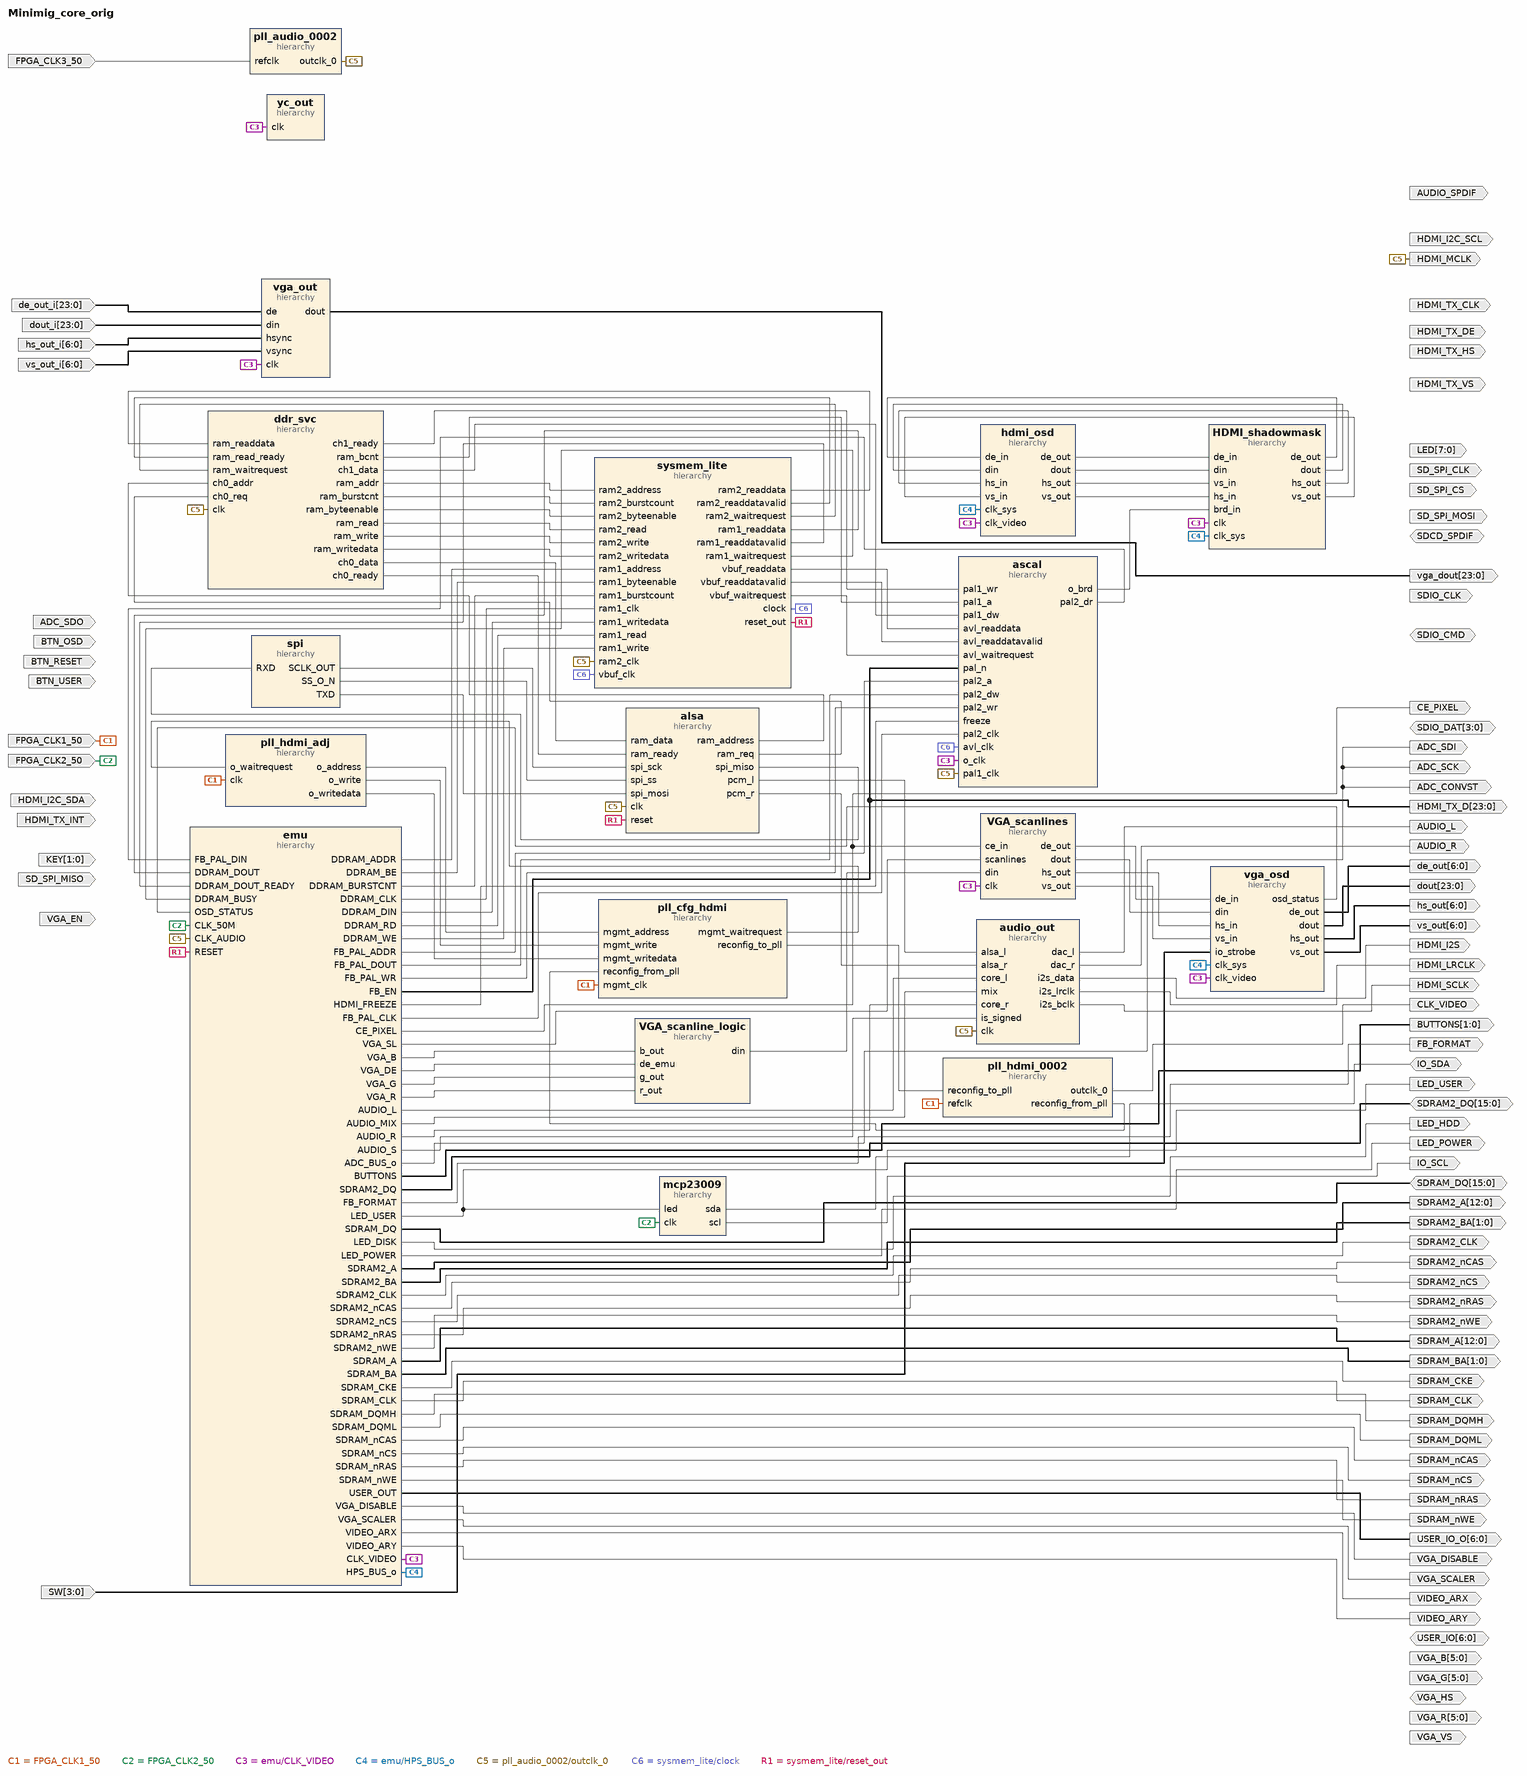
[diagram p0: block diagram of the top level]
# Vivado block design Minimig_core_orig, xc7a200tfbg484-2, Vivado 2024.2.1
create_bd_design Minimig_core_orig

create_bd_port -dir I -type clk FPGA_CLK1_50
set_property -dict {CONFIG.FREQ_HZ 50000000} [get_bd_ports FPGA_CLK1_50]
create_bd_port -dir I -type clk FPGA_CLK2_50
set_property -dict {CONFIG.FREQ_HZ 50000000} [get_bd_ports FPGA_CLK2_50]
create_bd_port -dir I -type clk FPGA_CLK3_50
set_property -dict {CONFIG.FREQ_HZ 50000000} [get_bd_ports FPGA_CLK3_50]
create_bd_port -dir O HDMI_I2C_SCL
create_bd_port -dir I HDMI_I2C_SDA
create_bd_port -dir O HDMI_MCLK
create_bd_port -dir O HDMI_SCLK
create_bd_port -dir O HDMI_LRCLK
create_bd_port -dir O HDMI_I2S
create_bd_port -dir O HDMI_TX_DE
create_bd_port -dir O HDMI_TX_CLK
create_bd_port -dir O -from 23 -to 0 HDMI_TX_D
create_bd_port -dir O HDMI_TX_HS
create_bd_port -dir O HDMI_TX_VS
create_bd_port -dir I HDMI_TX_INT
create_bd_port -dir O -from 12 -to 0 SDRAM_A
create_bd_port -dir O SDRAM_DQML
create_bd_port -dir O SDRAM_DQMH
create_bd_port -dir O SDRAM_nWE
create_bd_port -dir O SDRAM_nCAS
create_bd_port -dir O SDRAM_nRAS
create_bd_port -dir O SDRAM_nCS
create_bd_port -dir O -from 1 -to 0 SDRAM_BA
create_bd_port -dir O -type clk SDRAM_CLK
create_bd_port -dir O SDRAM_CKE
create_bd_port -dir O -from 12 -to 0 SDRAM2_A
create_bd_port -dir IO -from 15 -to 0 SDRAM2_DQ
create_bd_port -dir O SDRAM2_nWE
create_bd_port -dir O SDRAM2_nCAS
create_bd_port -dir O SDRAM2_nRAS
create_bd_port -dir O SDRAM2_nCS
create_bd_port -dir O -from 1 -to 0 SDRAM2_BA
create_bd_port -dir O -type clk SDRAM2_CLK
create_bd_port -dir O -from 5 -to 0 VGA_R
create_bd_port -dir O -from 5 -to 0 VGA_G
create_bd_port -dir O -from 5 -to 0 VGA_B
create_bd_port -dir IO VGA_HS
create_bd_port -dir O VGA_VS
create_bd_port -dir I VGA_EN
create_bd_port -dir O AUDIO_L
create_bd_port -dir O AUDIO_R
create_bd_port -dir O AUDIO_SPDIF
create_bd_port -dir IO -from 3 -to 0 SDIO_DAT
create_bd_port -dir IO SDIO_CMD
create_bd_port -dir O -type clk SDIO_CLK
create_bd_port -dir O LED_USER
create_bd_port -dir O LED_HDD
create_bd_port -dir O LED_POWER
create_bd_port -dir I BTN_USER
create_bd_port -dir I BTN_OSD
create_bd_port -dir I BTN_RESET
create_bd_port -dir O SD_SPI_CS
create_bd_port -dir I SD_SPI_MISO
create_bd_port -dir O -type clk SD_SPI_CLK
create_bd_port -dir O SD_SPI_MOSI
create_bd_port -dir IO SDCD_SPDIF
create_bd_port -dir O IO_SCL
create_bd_port -dir IO IO_SDA
create_bd_port -dir O ADC_SCK
create_bd_port -dir I ADC_SDO
create_bd_port -dir O ADC_SDI
create_bd_port -dir O ADC_CONVST
create_bd_port -dir I -from 1 -to 0 KEY
create_bd_port -dir I -from 3 -to 0 SW
create_bd_port -dir O -from 7 -to 0 LED
create_bd_port -dir IO -from 6 -to 0 USER_IO
create_bd_port -dir O CE_PIXEL
create_bd_port -dir O VIDEO_ARX
create_bd_port -dir O VIDEO_ARY
create_bd_port -dir O VGA_SCALER
create_bd_port -dir O VGA_DISABLE
create_bd_port -dir O FB_FORMAT
create_bd_port -dir O -from 1 -to 0 BUTTONS
create_bd_port -dir IO -from 15 -to 0 SDRAM_DQ
create_bd_port -dir O -from 6 -to 0 USER_IO_O
create_bd_port -dir O CLK_VIDEO
create_bd_port -dir O -from 23 -to 0 dout
create_bd_port -dir O -from 6 -to 0 de_out
create_bd_port -dir O -from 6 -to 0 vs_out
create_bd_port -dir O -from 6 -to 0 hs_out
create_bd_port -dir I -from 6 -to 0 hs_out_i
create_bd_port -dir I -from 6 -to 0 vs_out_i
create_bd_port -dir I -from 23 -to 0 de_out_i
create_bd_port -dir I -from 23 -to 0 dout_i
create_bd_port -dir O -from 23 -to 0 vga_dout

create_bd_cell -type hier HDMI_shadowmask
create_bd_cell -type hier VGA_scanlines
create_bd_cell -type hier alsa
create_bd_cell -type hier ascal
create_bd_cell -type hier audio_out
create_bd_cell -type hier ddr_svc
create_bd_cell -type hier emu
create_bd_cell -type hier hdmi_osd
create_bd_cell -type hier mcp23009
create_bd_cell -type hier pll_audio_0002
create_bd_cell -type hier pll_cfg_hdmi
create_bd_cell -type hier pll_hdmi_0002
create_bd_cell -type hier pll_hdmi_adj
create_bd_cell -type hier sysmem_lite
create_bd_cell -type hier vga_out
create_bd_cell -type hier yc_out
create_bd_cell -type hier vga_osd
create_bd_cell -type hier VGA_scanline_logic
create_bd_cell -type hier spi

# ---- hierarchy /HDMI_shadowmask ----
current_bd_instance /HDMI_shadowmask
create_bd_pin -dir I clk
create_bd_pin -dir I clk_sys
create_bd_pin -dir I cmd_wr
create_bd_pin -dir I -from 15 -to 0 cmd_in
create_bd_pin -dir I -from 23 -to 0 din
create_bd_pin -dir I hs_in
create_bd_pin -dir I vs_in
create_bd_pin -dir I de_in
create_bd_pin -dir I brd_in
create_bd_pin -dir I enable
create_bd_pin -dir O -from 23 -to 0 dout
create_bd_pin -dir O hs_out
create_bd_pin -dir O vs_out
create_bd_pin -dir O de_out

# ---- hierarchy /VGA_scanlines ----
current_bd_instance /VGA_scanlines
create_bd_pin -dir I clk
create_bd_pin -dir I -from 23 -to 0 din
create_bd_pin -dir I -from 1 -to 0 scanlines
create_bd_pin -dir I hs_in
create_bd_pin -dir I vs_in
create_bd_pin -dir I de_in
create_bd_pin -dir I ce_in
create_bd_pin -dir O -from 23 -to 0 dout
create_bd_pin -dir O hs_out
create_bd_pin -dir O vs_out
create_bd_pin -dir O de_out
create_bd_pin -dir O ce_out

# ---- hierarchy /alsa ----
current_bd_instance /alsa
create_bd_pin -dir I reset
create_bd_pin -dir I clk
create_bd_pin -dir O -from 31 -to 3 ram_address
create_bd_pin -dir I -from 63 -to 0 ram_data
create_bd_pin -dir O ram_req
create_bd_pin -dir I ram_ready
create_bd_pin -dir I spi_ss
create_bd_pin -dir I spi_sck
create_bd_pin -dir I spi_mosi
create_bd_pin -dir O spi_miso
create_bd_pin -dir O -from 15 -to 0 pcm_l
create_bd_pin -dir O -from 15 -to 0 pcm_r

# ---- hierarchy /ascal ----
current_bd_instance /ascal
create_bd_pin -dir I -from 7 -to 0 i_r
create_bd_pin -dir I -from 7 -to 0 i_g
create_bd_pin -dir I -from 7 -to 0 i_b
create_bd_pin -dir I i_hs
create_bd_pin -dir I i_vs
create_bd_pin -dir I i_fl
create_bd_pin -dir I i_de
create_bd_pin -dir I i_ce
create_bd_pin -dir I i_clk
create_bd_pin -dir O -from 7 -to 0 o_r
create_bd_pin -dir O -from 7 -to 0 o_g
create_bd_pin -dir O -from 7 -to 0 o_b
create_bd_pin -dir O o_hs
create_bd_pin -dir O o_vs
create_bd_pin -dir O o_de
create_bd_pin -dir O o_vbl
create_bd_pin -dir O o_brd
create_bd_pin -dir I o_ce
create_bd_pin -dir I o_clk
create_bd_pin -dir I -from 23 -to 0 o_border
create_bd_pin -dir I o_fb_ena
create_bd_pin -dir I o_fb_hsize
create_bd_pin -dir I o_fb_vsize
create_bd_pin -dir I -from 5 -to 0 o_fb_format
create_bd_pin -dir I -from 31 -to 0 o_fb_base
create_bd_pin -dir I -from 13 -to 0 o_fb_stride
create_bd_pin -dir I pal1_clk
create_bd_pin -dir I -from 47 -to 0 pal1_dw
create_bd_pin -dir O -from 47 -to 0 pal1_dr
create_bd_pin -dir I -from 6 -to 0 pal1_a
create_bd_pin -dir I pal1_wr
create_bd_pin -dir I pal_n
create_bd_pin -dir I pal2_clk
create_bd_pin -dir I -from 23 -to 0 pal2_dw
create_bd_pin -dir O -from 23 -to 0 pal2_dr
create_bd_pin -dir I -from 7 -to 0 pal2_a
create_bd_pin -dir I pal2_wr
create_bd_pin -dir O -from 15 -to 0 o_lltune
create_bd_pin -dir I iauto
create_bd_pin -dir I himin
create_bd_pin -dir I himax
create_bd_pin -dir I vimin
create_bd_pin -dir I vimax
create_bd_pin -dir O i_hdmax
create_bd_pin -dir O i_vdmax
create_bd_pin -dir I run
create_bd_pin -dir I freeze
create_bd_pin -dir I -from 4 -to 0 mode
create_bd_pin -dir I htotal
create_bd_pin -dir I hsstart
create_bd_pin -dir I hsend
create_bd_pin -dir I hdisp
create_bd_pin -dir I hmin
create_bd_pin -dir I hmax
create_bd_pin -dir I vtotal
create_bd_pin -dir I vsstart
create_bd_pin -dir I vsend
create_bd_pin -dir I vdisp
create_bd_pin -dir I vmin
create_bd_pin -dir I vmax
create_bd_pin -dir I vrr
create_bd_pin -dir I vrrmax
create_bd_pin -dir I -from 1 -to 0 format
create_bd_pin -dir I poly_clk
create_bd_pin -dir I -from 9 -to 0 poly_dw
create_bd_pin -dir I -from 7 -to 0 poly_a
create_bd_pin -dir I poly_wr
create_bd_pin -dir I avl_clk
create_bd_pin -dir I avl_waitrequest
create_bd_pin -dir I -from 127 -to 0 avl_readdata
create_bd_pin -dir I avl_readdatavalid
create_bd_pin -dir O -from 7 -to 0 avl_burstcount
create_bd_pin -dir O -from 127 -to 0 avl_writedata
create_bd_pin -dir O -from 31 -to 0 avl_address
create_bd_pin -dir O avl_write
create_bd_pin -dir O avl_read
create_bd_pin -dir O -from 15 -to 0 avl_byteenable
create_bd_pin -dir I reset_na

# ---- hierarchy /audio_out ----
current_bd_instance /audio_out
create_bd_pin -dir I reset
create_bd_pin -dir I clk
create_bd_pin -dir I sample_rate
create_bd_pin -dir I -from 31 -to 0 flt_rate
create_bd_pin -dir I -from 39 -to 0 cx
create_bd_pin -dir I -from 7 -to 0 cx0
create_bd_pin -dir I -from 7 -to 0 cx1
create_bd_pin -dir I -from 7 -to 0 cx2
create_bd_pin -dir I -from 23 -to 0 cy0
create_bd_pin -dir I -from 23 -to 0 cy1
create_bd_pin -dir I -from 23 -to 0 cy2
create_bd_pin -dir I -from 4 -to 0 att
create_bd_pin -dir I -from 1 -to 0 mix
create_bd_pin -dir I is_signed
create_bd_pin -dir I -from 15 -to 0 core_l
create_bd_pin -dir I -from 15 -to 0 core_r
create_bd_pin -dir I -from 15 -to 0 alsa_l
create_bd_pin -dir I -from 15 -to 0 alsa_r
create_bd_pin -dir O i2s_bclk
create_bd_pin -dir O i2s_lrclk
create_bd_pin -dir O i2s_data
create_bd_pin -dir O spdif
create_bd_pin -dir O dac_l
create_bd_pin -dir O dac_r

# ---- hierarchy /ddr_svc ----
current_bd_instance /ddr_svc
create_bd_pin -dir I clk
create_bd_pin -dir I ram_waitrequest
create_bd_pin -dir O -from 7 -to 0 ram_burstcnt
create_bd_pin -dir O -from 28 -to 0 ram_addr
create_bd_pin -dir I -from 63 -to 0 ram_readdata
create_bd_pin -dir I ram_read_ready
create_bd_pin -dir O ram_read
create_bd_pin -dir O -from 63 -to 0 ram_writedata
create_bd_pin -dir O -from 7 -to 0 ram_byteenable
create_bd_pin -dir O ram_write
create_bd_pin -dir O -from 7 -to 0 ram_bcnt
create_bd_pin -dir I -from 31 -to 3 ch0_addr
create_bd_pin -dir I -from 7 -to 0 ch0_burst
create_bd_pin -dir O -from 63 -to 0 ch0_data
create_bd_pin -dir I ch0_req
create_bd_pin -dir O ch0_ready
create_bd_pin -dir I -from 31 -to 3 ch1_addr
create_bd_pin -dir I -from 7 -to 0 ch1_burst
create_bd_pin -dir O -from 63 -to 0 ch1_data
create_bd_pin -dir I ch1_req
create_bd_pin -dir O ch1_ready

# ---- hierarchy /emu ----
current_bd_instance /emu
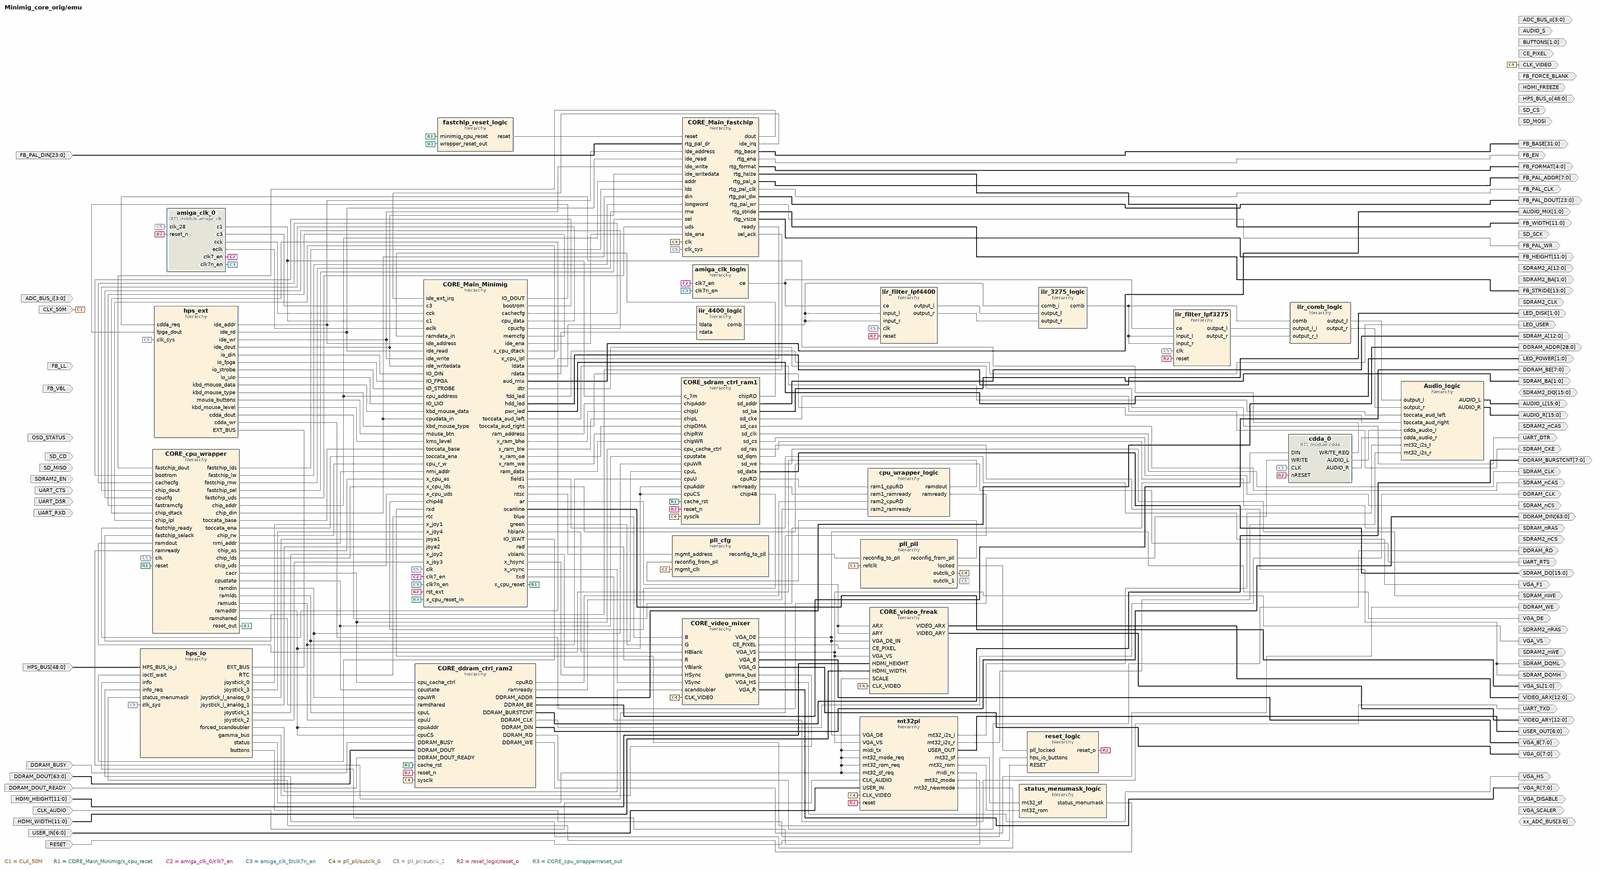
[diagram p1: block diagram inside /emu, whole]
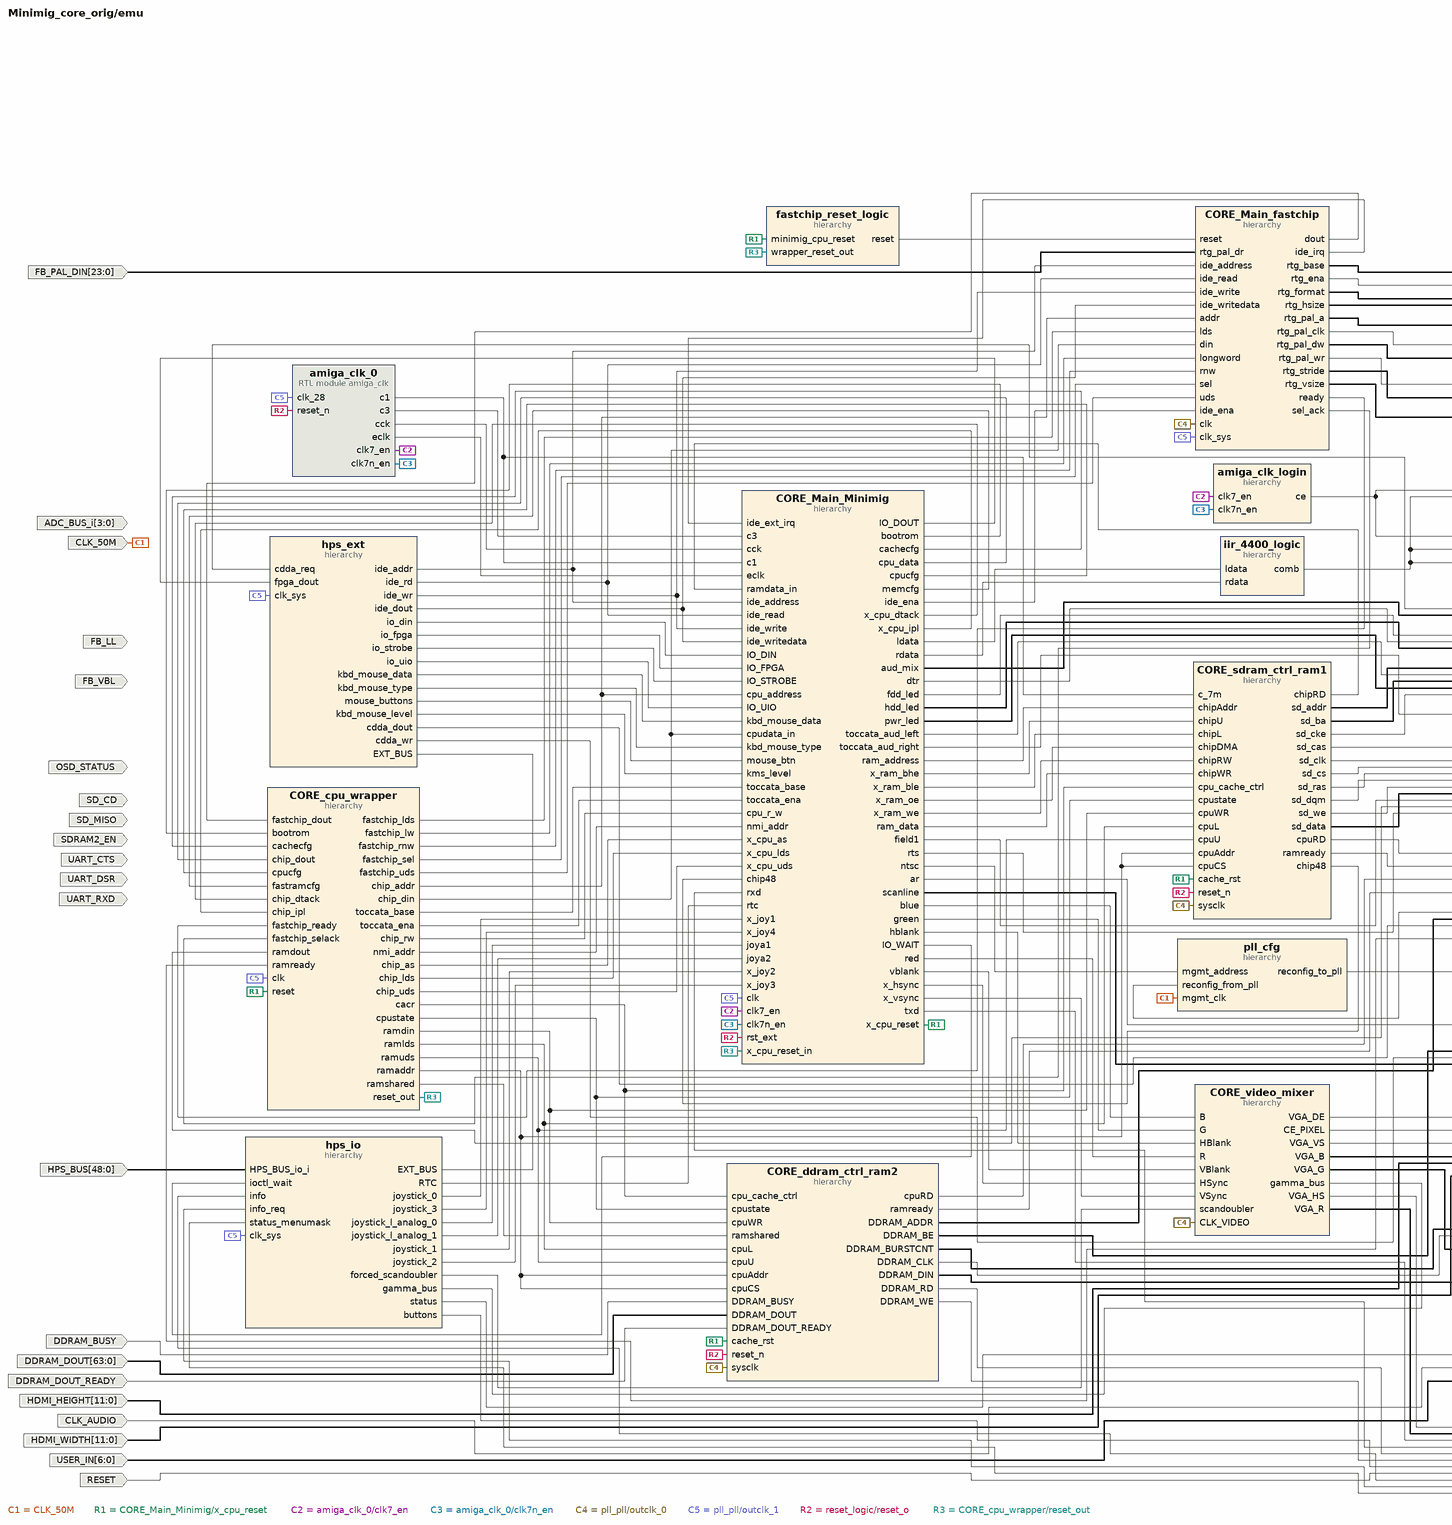
[diagram p2: block diagram inside /emu, left part]
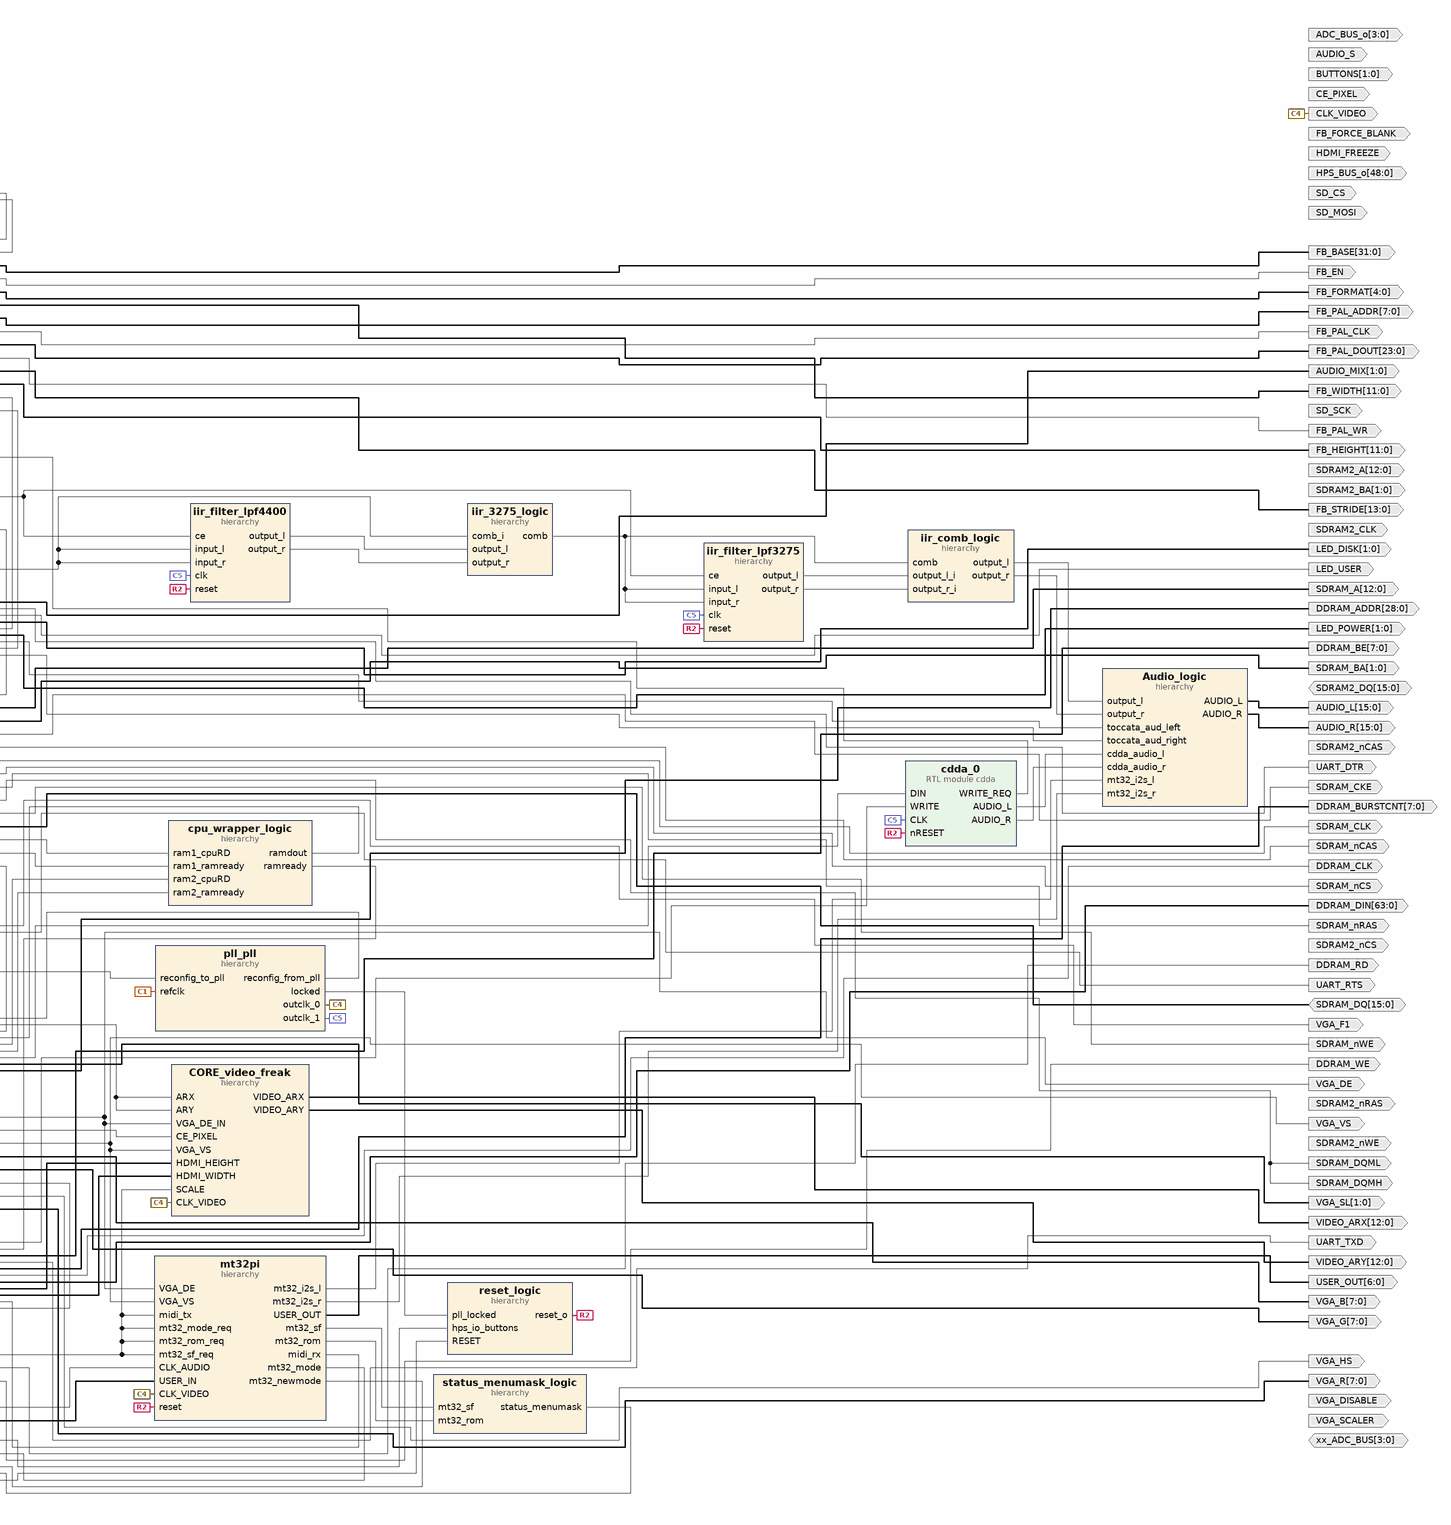
[diagram p3: block diagram inside /emu, right part]
create_bd_pin -dir I CLK_50M
create_bd_pin -dir I RESET
create_bd_pin -dir I -from 48 -to 0 HPS_BUS
create_bd_pin -dir O CLK_VIDEO
create_bd_pin -dir O CE_PIXEL
create_bd_pin -dir O -from 12 -to 0 VIDEO_ARX
create_bd_pin -dir O -from 12 -to 0 VIDEO_ARY
create_bd_pin -dir O -from 7 -to 0 VGA_R
create_bd_pin -dir O -from 7 -to 0 VGA_G
create_bd_pin -dir O -from 7 -to 0 VGA_B
create_bd_pin -dir O VGA_HS
create_bd_pin -dir O VGA_VS
create_bd_pin -dir O VGA_DE
create_bd_pin -dir O VGA_F1
create_bd_pin -dir O -from 1 -to 0 VGA_SL
create_bd_pin -dir O VGA_SCALER
create_bd_pin -dir O VGA_DISABLE
create_bd_pin -dir I -from 11 -to 0 HDMI_WIDTH
create_bd_pin -dir I -from 11 -to 0 HDMI_HEIGHT
create_bd_pin -dir O HDMI_FREEZE
create_bd_pin -dir O FB_EN
create_bd_pin -dir O -from 4 -to 0 FB_FORMAT
create_bd_pin -dir O -from 11 -to 0 FB_WIDTH
create_bd_pin -dir O -from 11 -to 0 FB_HEIGHT
create_bd_pin -dir O -from 31 -to 0 FB_BASE
create_bd_pin -dir O -from 13 -to 0 FB_STRIDE
create_bd_pin -dir I FB_VBL
create_bd_pin -dir I FB_LL
create_bd_pin -dir O FB_FORCE_BLANK
create_bd_pin -dir O FB_PAL_CLK
create_bd_pin -dir O -from 7 -to 0 FB_PAL_ADDR
create_bd_pin -dir O -from 23 -to 0 FB_PAL_DOUT
create_bd_pin -dir I -from 23 -to 0 FB_PAL_DIN
create_bd_pin -dir O FB_PAL_WR
create_bd_pin -dir O LED_USER
create_bd_pin -dir O -from 1 -to 0 LED_POWER
create_bd_pin -dir O -from 1 -to 0 LED_DISK
create_bd_pin -dir O -from 1 -to 0 BUTTONS
create_bd_pin -dir I CLK_AUDIO
create_bd_pin -dir O -from 15 -to 0 AUDIO_L
create_bd_pin -dir O -from 15 -to 0 AUDIO_R
create_bd_pin -dir O AUDIO_S
create_bd_pin -dir O -from 1 -to 0 AUDIO_MIX
create_bd_pin -dir IO -from 3 -to 0 xx_ADC_BUS
create_bd_pin -dir O SD_SCK
create_bd_pin -dir O SD_MOSI
create_bd_pin -dir I SD_MISO
create_bd_pin -dir O SD_CS
create_bd_pin -dir I SD_CD
create_bd_pin -dir O DDRAM_CLK
create_bd_pin -dir I DDRAM_BUSY
create_bd_pin -dir O -from 7 -to 0 DDRAM_BURSTCNT
create_bd_pin -dir O -from 28 -to 0 DDRAM_ADDR
create_bd_pin -dir I -from 63 -to 0 DDRAM_DOUT
create_bd_pin -dir I DDRAM_DOUT_READY
create_bd_pin -dir O DDRAM_RD
create_bd_pin -dir O -from 63 -to 0 DDRAM_DIN
create_bd_pin -dir O -from 7 -to 0 DDRAM_BE
create_bd_pin -dir O DDRAM_WE
create_bd_pin -dir O SDRAM_CLK
create_bd_pin -dir O SDRAM_CKE
create_bd_pin -dir O -from 12 -to 0 SDRAM_A
create_bd_pin -dir O -from 1 -to 0 SDRAM_BA
create_bd_pin -dir IO -from 15 -to 0 SDRAM_DQ
create_bd_pin -dir O SDRAM_DQML
create_bd_pin -dir O SDRAM_DQMH
create_bd_pin -dir O SDRAM_nCS
create_bd_pin -dir O SDRAM_nCAS
create_bd_pin -dir O SDRAM_nRAS
create_bd_pin -dir O SDRAM_nWE
create_bd_pin -dir I SDRAM2_EN
create_bd_pin -dir O SDRAM2_CLK
create_bd_pin -dir O -from 12 -to 0 SDRAM2_A
create_bd_pin -dir O -from 1 -to 0 SDRAM2_BA
create_bd_pin -dir IO -from 15 -to 0 SDRAM2_DQ
create_bd_pin -dir O SDRAM2_nCS
create_bd_pin -dir O SDRAM2_nCAS
create_bd_pin -dir O SDRAM2_nRAS
create_bd_pin -dir O SDRAM2_nWE
create_bd_pin -dir I UART_CTS
create_bd_pin -dir O UART_RTS
create_bd_pin -dir I UART_RXD
create_bd_pin -dir O UART_TXD
create_bd_pin -dir O UART_DTR
create_bd_pin -dir I UART_DSR
create_bd_pin -dir I -from 6 -to 0 USER_IN
create_bd_pin -dir O -from 6 -to 0 USER_OUT
create_bd_pin -dir I OSD_STATUS
create_bd_pin -dir O -from 48 -to 0 HPS_BUS_o
create_bd_pin -dir O -from 3 -to 0 ADC_BUS_o
create_bd_pin -dir I -from 3 -to 0 ADC_BUS_i

create_bd_cell -type module -reference amiga_clk amiga_clk_0
create_bd_cell -type hier pll_pll
create_bd_cell -type hier pll_cfg
create_bd_cell -type hier hps_io
create_bd_cell -type hier CORE_Main_Minimig
create_bd_cell -type hier CORE_ddram_ctrl_ram2
create_bd_cell -type hier CORE_sdram_ctrl_ram1
create_bd_cell -type hier CORE_Main_fastchip
create_bd_cell -type hier CORE_cpu_wrapper
create_bd_cell -type hier CORE_video_mixer
create_bd_cell -type hier hps_ext
create_bd_cell -type module -reference cdda cdda_0
create_bd_cell -type hier iir_filter_lpf3275
create_bd_cell -type hier iir_filter_lpf4400
create_bd_cell -type hier Audio_logic
create_bd_cell -type hier iir_4400_logic
create_bd_cell -type hier iir_3275_logic
create_bd_cell -type hier iir_comb_logic
create_bd_cell -type hier amiga_clk_login
create_bd_cell -type hier reset_logic
create_bd_cell -type hier fastchip_reset_logic
create_bd_cell -type hier cpu_wrapper_logic
create_bd_cell -type hier CORE_video_freak
create_bd_cell -type hier mt32pi
create_bd_cell -type hier status_menumask_logic

# ---- hierarchy /emu/pll_pll ----
current_bd_instance /emu/pll_pll
create_bd_pin -dir I refclk
create_bd_pin -dir O outclk_0
create_bd_pin -dir O locked
create_bd_pin -dir I -from 63 -to 0 reconfig_to_pll
create_bd_pin -dir O -from 63 -to 0 reconfig_from_pll
create_bd_pin -dir O outclk_1

# ---- hierarchy /emu/pll_cfg ----
current_bd_instance /emu/pll_cfg
create_bd_pin -dir I mgmt_clk
create_bd_pin -dir I mgmt_reset
create_bd_pin -dir O -from 63 -to 0 reconfig_to_pll
create_bd_pin -dir I -from 63 -to 0 reconfig_from_pll
create_bd_pin -dir O mgmt_waitrequest
create_bd_pin -dir I -from 5 -to 0 mgmt_address
create_bd_pin -dir I mgmt_write
create_bd_pin -dir I -from 31 -to 0 mgmt_writedata

# ---- hierarchy /emu/hps_io ----
current_bd_instance /emu/hps_io
create_bd_pin -dir I clk_sys
create_bd_pin -dir IO -from 48 -to 0 HPS_BUS
create_bd_pin -dir O -from 31 -to 0 joystick_0
create_bd_pin -dir O -from 31 -to 0 joystick_1
create_bd_pin -dir O -from 31 -to 0 joystick_2
create_bd_pin -dir O -from 31 -to 0 joystick_3
create_bd_pin -dir O -from 31 -to 0 joystick_4
create_bd_pin -dir O -from 31 -to 0 joystick_5
create_bd_pin -dir O -from 15 -to 0 joystick_l_analog_0
create_bd_pin -dir O -from 15 -to 0 joystick_l_analog_1
create_bd_pin -dir O -from 15 -to 0 joystick_l_analog_2
create_bd_pin -dir O -from 15 -to 0 joystick_l_analog_3
create_bd_pin -dir O -from 15 -to 0 joystick_l_analog_4
create_bd_pin -dir O -from 15 -to 0 joystick_l_analog_5
create_bd_pin -dir O -from 15 -to 0 joystick_r_analog_0
create_bd_pin -dir O -from 15 -to 0 joystick_r_analog_1
create_bd_pin -dir O -from 15 -to 0 joystick_r_analog_2
create_bd_pin -dir O -from 15 -to 0 joystick_r_analog_3
create_bd_pin -dir O -from 15 -to 0 joystick_r_analog_4
create_bd_pin -dir O -from 15 -to 0 joystick_r_analog_5
create_bd_pin -dir I -from 15 -to 0 joystick_0_rumble
create_bd_pin -dir I -from 15 -to 0 joystick_1_rumble
create_bd_pin -dir I -from 15 -to 0 joystick_2_rumble
create_bd_pin -dir I -from 15 -to 0 joystick_3_rumble
create_bd_pin -dir I -from 15 -to 0 joystick_4_rumble
create_bd_pin -dir I -from 15 -to 0 joystick_5_rumble
create_bd_pin -dir O -from 7 -to 0 paddle_0
create_bd_pin -dir O -from 7 -to 0 paddle_1
create_bd_pin -dir O -from 7 -to 0 paddle_2
create_bd_pin -dir O -from 7 -to 0 paddle_3
create_bd_pin -dir O -from 7 -to 0 paddle_4
create_bd_pin -dir O -from 7 -to 0 paddle_5
create_bd_pin -dir O -from 8 -to 0 spinner_0
create_bd_pin -dir O -from 8 -to 0 spinner_1
create_bd_pin -dir O -from 8 -to 0 spinner_2
create_bd_pin -dir O -from 8 -to 0 spinner_3
create_bd_pin -dir O -from 8 -to 0 spinner_4
create_bd_pin -dir O -from 8 -to 0 spinner_5
create_bd_pin -dir O ps2_kbd_clk_out
create_bd_pin -dir O ps2_kbd_data_out
create_bd_pin -dir I ps2_kbd_clk_in
create_bd_pin -dir I ps2_kbd_data_in
create_bd_pin -dir I -from 2 -to 0 ps2_kbd_led_status
create_bd_pin -dir I -from 2 -to 0 ps2_kbd_led_use
create_bd_pin -dir O ps2_mouse_clk_out
create_bd_pin -dir O ps2_mouse_data_out
create_bd_pin -dir I ps2_mouse_clk_in
create_bd_pin -dir I ps2_mouse_data_in
create_bd_pin -dir O -from 10 -to 0 ps2_key
create_bd_pin -dir O -from 24 -to 0 ps2_mouse
create_bd_pin -dir O -from 15 -to 0 ps2_mouse_ext
create_bd_pin -dir O forced_scandoubler
create_bd_pin -dir O direct_video
create_bd_pin -dir I video_rotated
create_bd_pin -dir I new_vmode
create_bd_pin -dir IO -from 21 -to 0 gamma_bus
create_bd_pin -dir O -from 127 -to 0 status
create_bd_pin -dir I -from 127 -to 0 status_in
create_bd_pin -dir I status_set
create_bd_pin -dir I -from 15 -to 0 status_menumask
create_bd_pin -dir I info_req
create_bd_pin -dir I -from 7 -to 0 info
create_bd_pin -dir O -from 0 -to 0 img_mounted
create_bd_pin -dir O img_readonly
create_bd_pin -dir O -from 63 -to 0 img_size
create_bd_pin -dir I -from 31 -to 0 sd_lba
create_bd_pin -dir I -from 5 -to 0 sd_blk_cnt
create_bd_pin -dir I -from 0 -to 0 sd_rd
create_bd_pin -dir I -from 0 -to 0 sd_wr
create_bd_pin -dir O -from 0 -to 0 sd_ack
create_bd_pin -dir O -from 13 -to 0 sd_buff_addr
create_bd_pin -dir O -from 15 -to 0 sd_buff_dout
create_bd_pin -dir I -from 15 -to 0 sd_buff_din
create_bd_pin -dir O sd_buff_wr
create_bd_pin -dir O ioctl_download
create_bd_pin -dir O -from 15 -to 0 ioctl_index
create_bd_pin -dir O ioctl_wr
create_bd_pin -dir O -from 26 -to 0 ioctl_addr
create_bd_pin -dir O -from 15 -to 0 ioctl_dout
create_bd_pin -dir O ioctl_upload
create_bd_pin -dir I ioctl_upload_req
create_bd_pin -dir I -from 7 -to 0 ioctl_upload_index
create_bd_pin -dir I -from 15 -to 0 ioctl_din
create_bd_pin -dir O ioctl_rd
create_bd_pin -dir O -from 31 -to 0 ioctl_file_ext
create_bd_pin -dir I ioctl_wait
create_bd_pin -dir O -from 15 -to 0 sdram_sz
create_bd_pin -dir O -from 64 -to 0 RTC
create_bd_pin -dir O -from 32 -to 0 TIMESTAMP
create_bd_pin -dir O -from 7 -to 0 uart_mode
create_bd_pin -dir O -from 31 -to 0 uart_speed
create_bd_pin -dir IO -from 35 -to 0 EXT_BUS
create_bd_pin -dir I -from 48 -to 0 HPS_BUS_io_i
create_bd_pin -dir O -from 1 -to 0 buttons

# ---- hierarchy /emu/CORE_Main_Minimig ----
current_bd_instance /emu/CORE_Main_Minimig
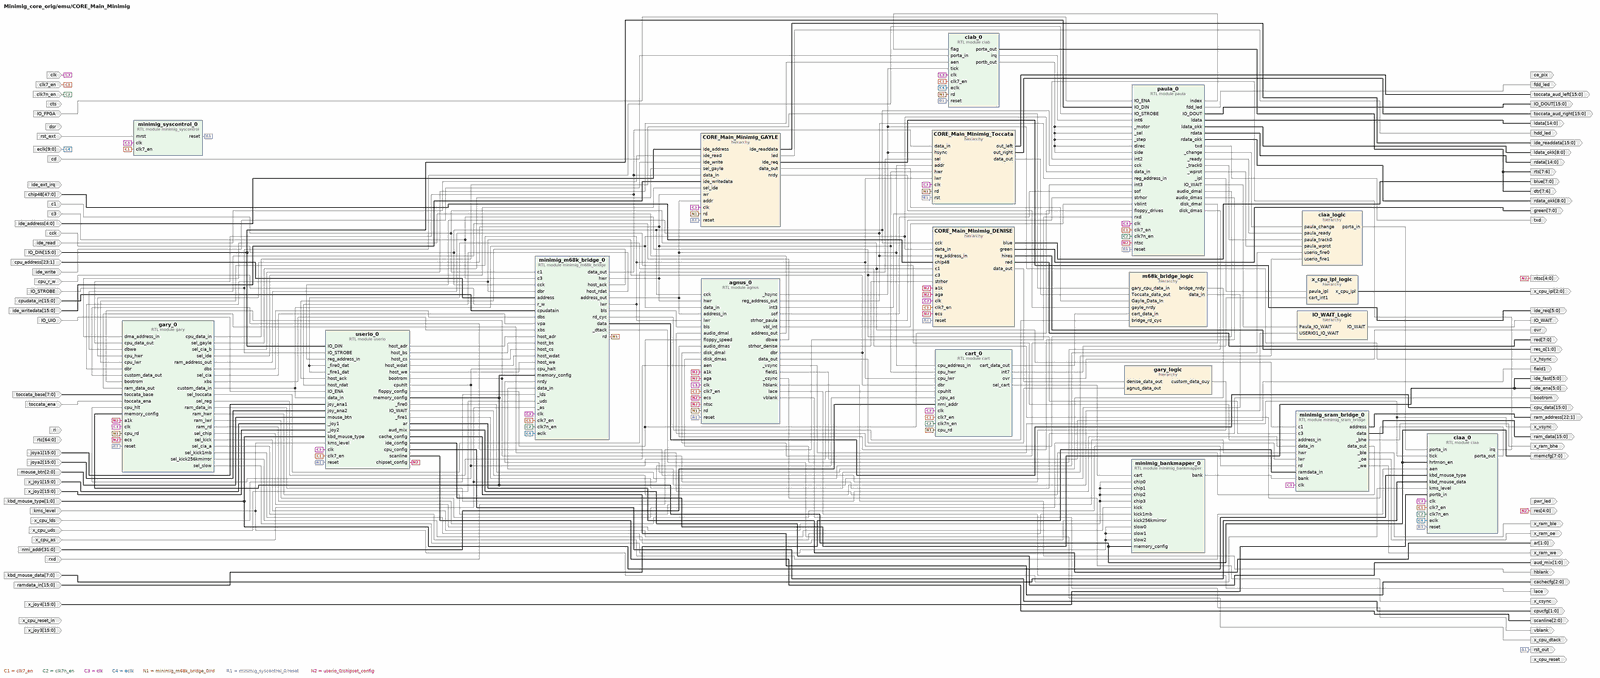
[diagram p4: block diagram inside /emu/CORE_Main_Minimig, whole]
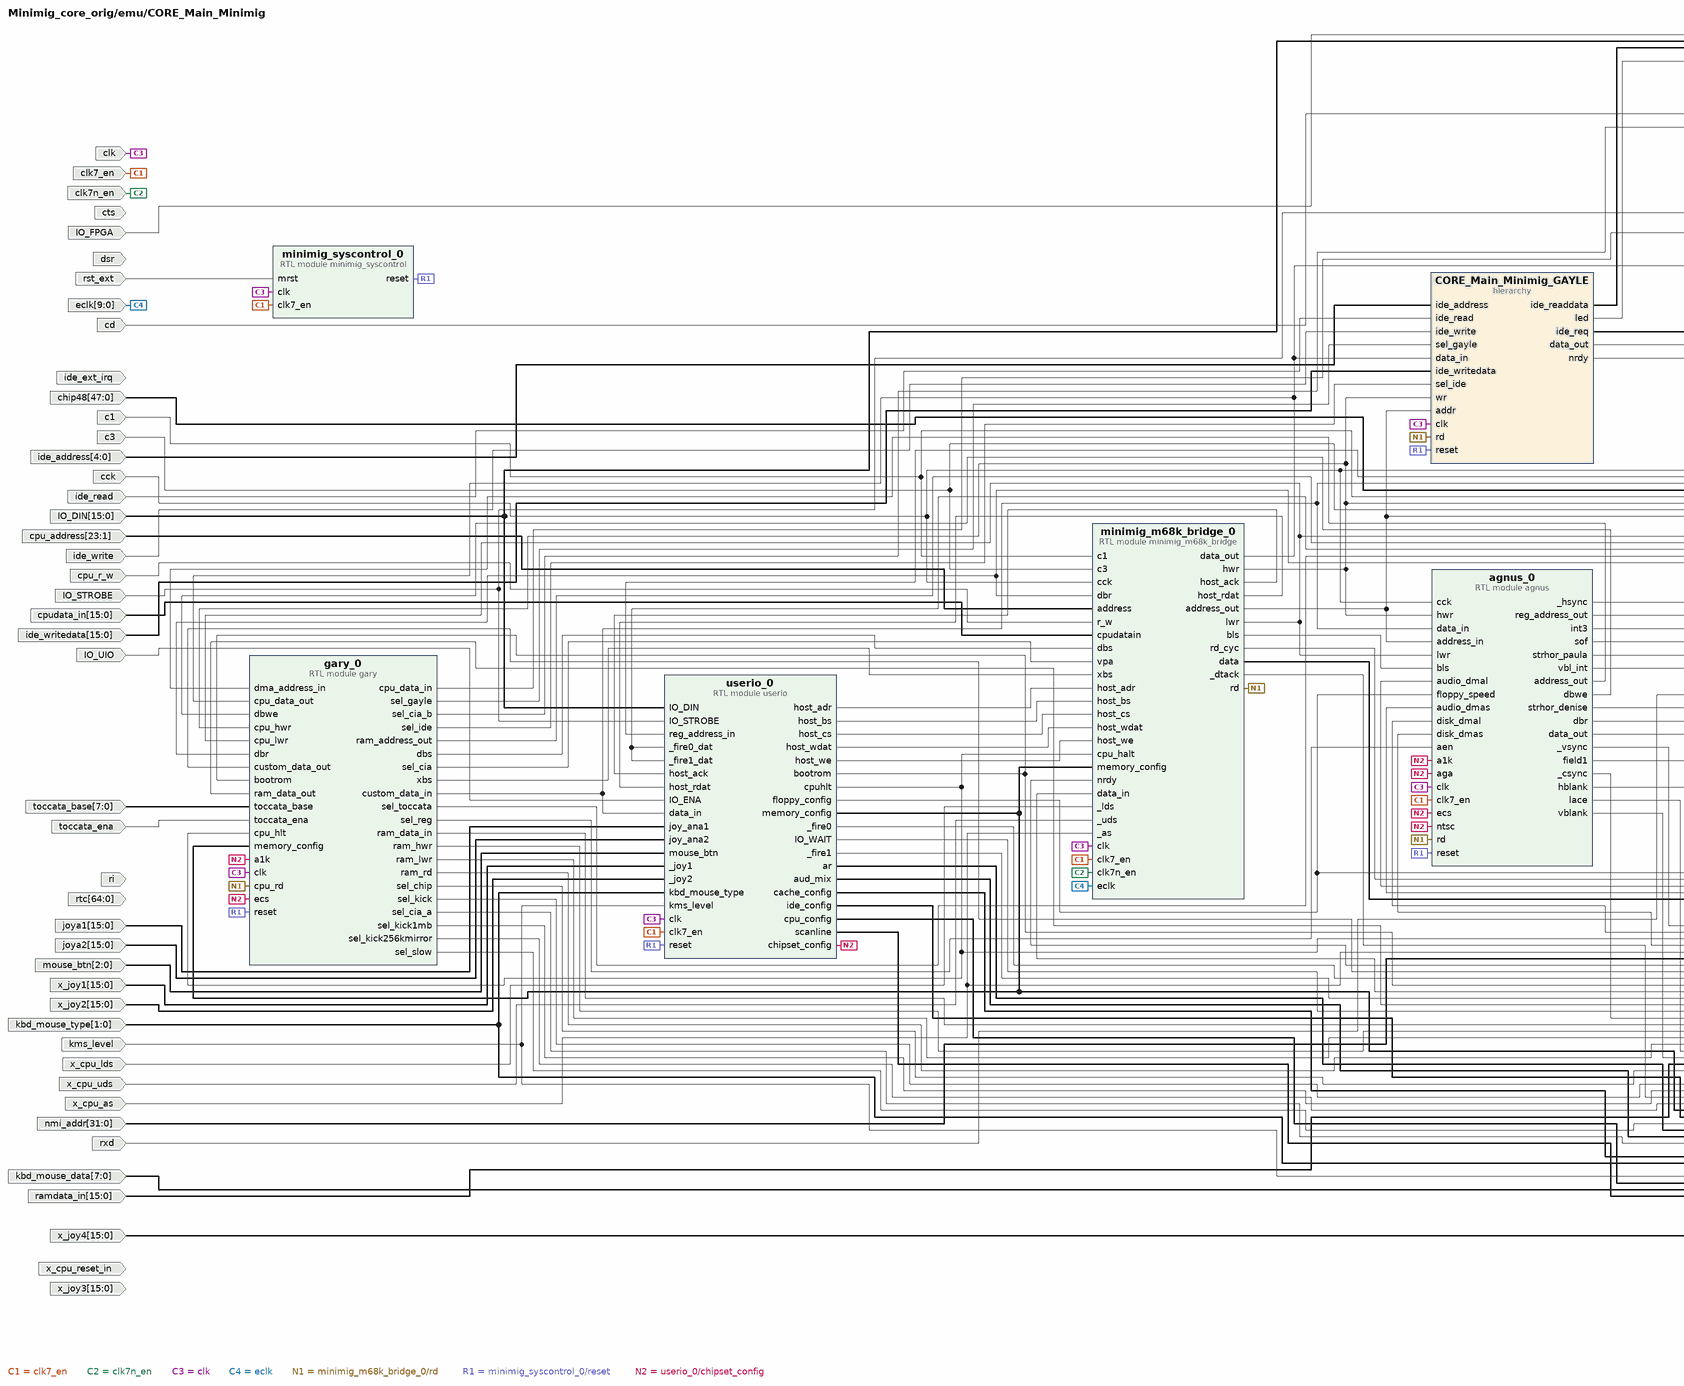
[diagram p5: block diagram inside /emu/CORE_Main_Minimig, left part]
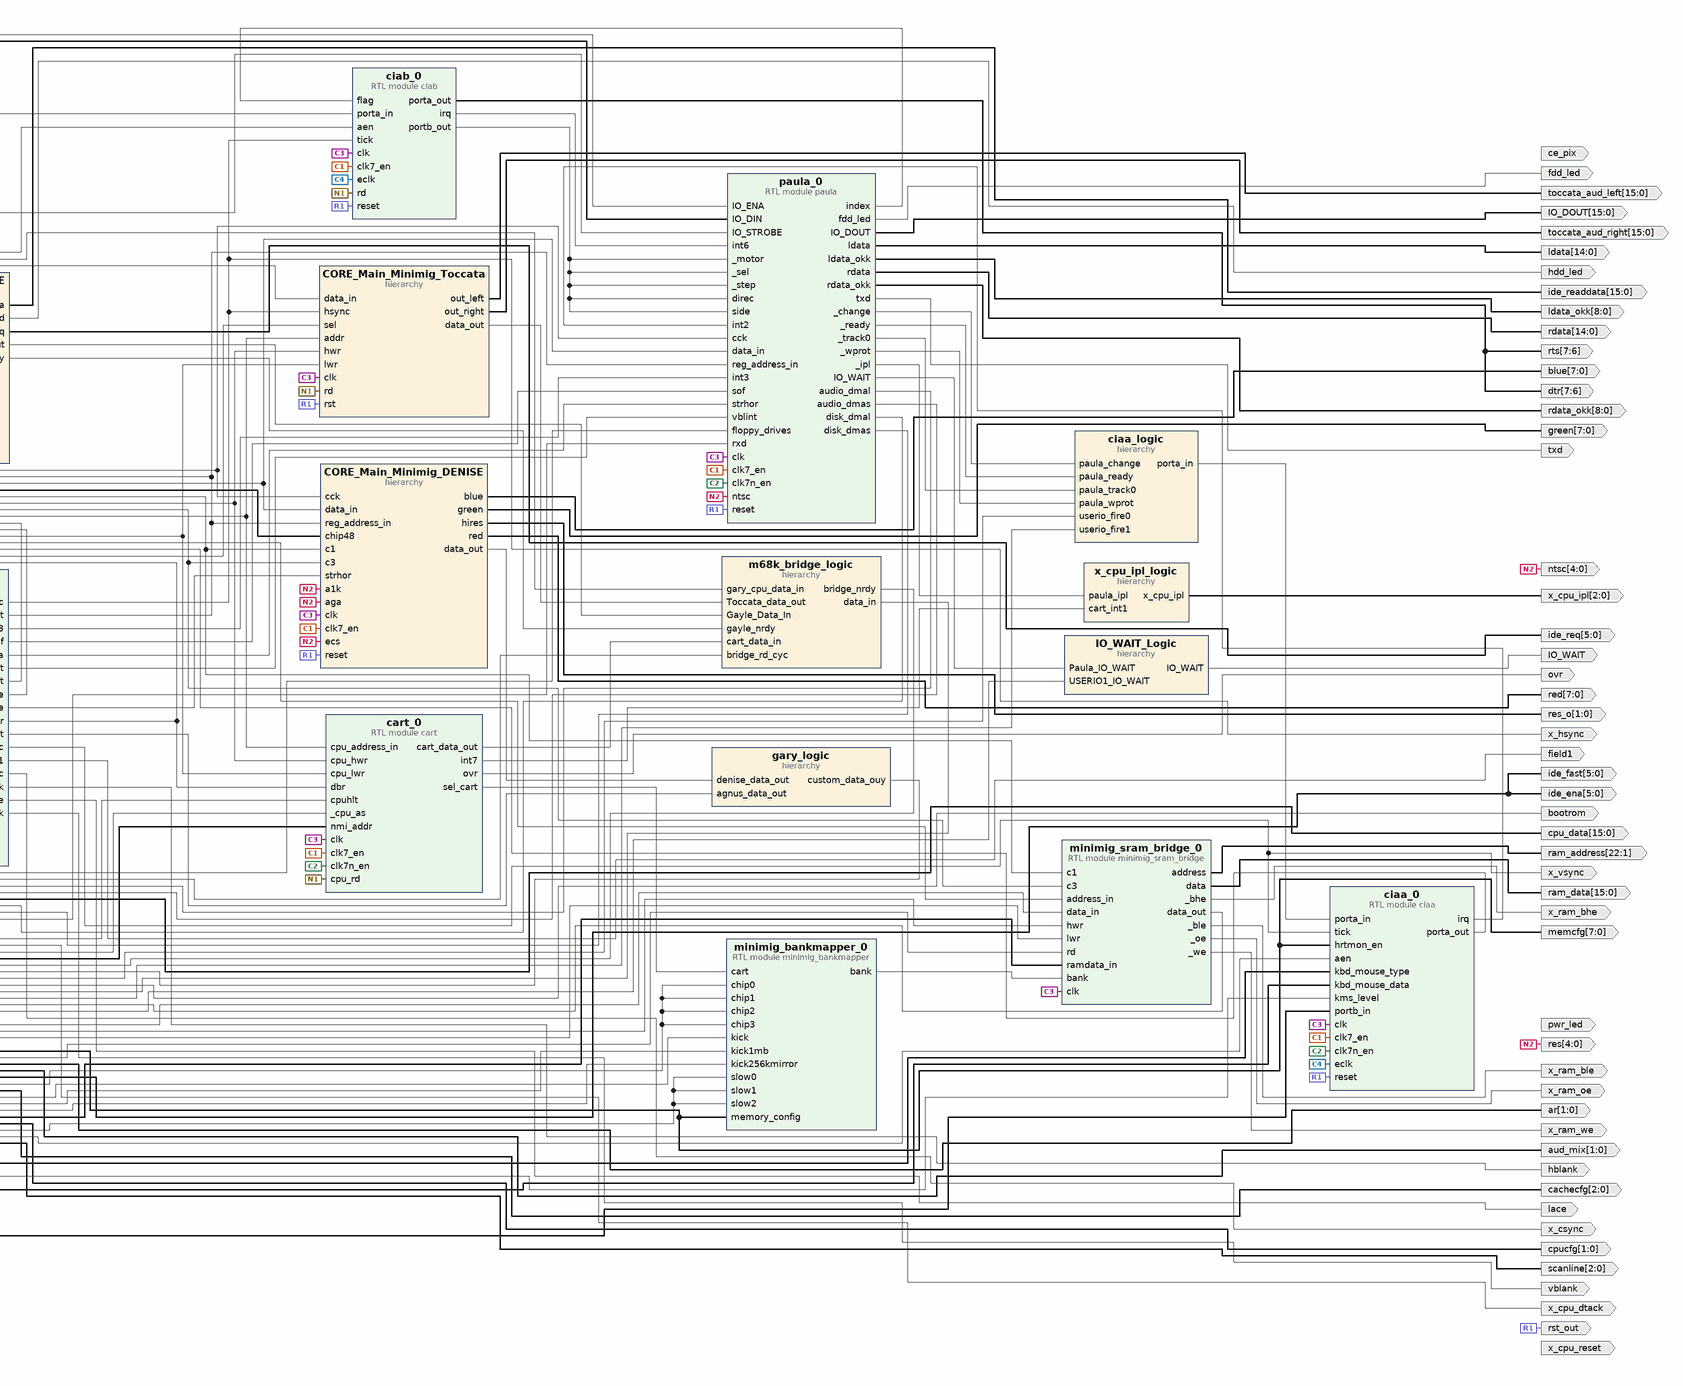
[diagram p6: block diagram inside /emu/CORE_Main_Minimig, right part]
create_bd_pin -dir I -from 23 -to 1 cpu_address
create_bd_pin -dir O -from 15 -to 0 cpu_data
create_bd_pin -dir I -from 15 -to 0 cpudata_in
create_bd_pin -dir O -from 2 -to 0 x_cpu_ipl
create_bd_pin -dir I x_cpu_as
create_bd_pin -dir I x_cpu_uds
create_bd_pin -dir I x_cpu_lds
create_bd_pin -dir I cpu_r_w
create_bd_pin -dir O x_cpu_dtack
create_bd_pin -dir O x_cpu_reset
create_bd_pin -dir I x_cpu_reset_in
create_bd_pin -dir I -from 31 -to 0 nmi_addr
create_bd_pin -dir O ovr
create_bd_pin -dir O -from 15 -to 0 ram_data
create_bd_pin -dir I -from 15 -to 0 ramdata_in
create_bd_pin -dir O -from 22 -to 1 ram_address
create_bd_pin -dir O x_ram_bhe
create_bd_pin -dir O x_ram_ble
create_bd_pin -dir O x_ram_we
create_bd_pin -dir O x_ram_oe
create_bd_pin -dir I -from 47 -to 0 chip48
create_bd_pin -dir I rst_ext
create_bd_pin -dir O rst_out
create_bd_pin -dir I clk
create_bd_pin -dir I clk7_en
create_bd_pin -dir I clk7n_en
create_bd_pin -dir I c1
create_bd_pin -dir I c3
create_bd_pin -dir I cck
create_bd_pin -dir I -from 9 -to 0 eclk
create_bd_pin -dir I rxd
create_bd_pin -dir O txd
create_bd_pin -dir I cts
create_bd_pin -dir O -from 7 -to 6 rts
create_bd_pin -dir O -from 7 -to 6 dtr
create_bd_pin -dir I dsr
create_bd_pin -dir I cd
create_bd_pin -dir I ri
create_bd_pin -dir I -from 15 -to 0 x_joy1
create_bd_pin -dir I -from 15 -to 0 x_joy2
create_bd_pin -dir I -from 15 -to 0 x_joy3
create_bd_pin -dir I -from 15 -to 0 x_joy4
create_bd_pin -dir I -from 15 -to 0 joya1
create_bd_pin -dir I -from 15 -to 0 joya2
create_bd_pin -dir I -from 2 -to 0 mouse_btn
create_bd_pin -dir I kms_level
create_bd_pin -dir I -from 1 -to 0 kbd_mouse_type
create_bd_pin -dir I -from 7 -to 0 kbd_mouse_data
create_bd_pin -dir O pwr_led
create_bd_pin -dir O fdd_led
create_bd_pin -dir O hdd_led
create_bd_pin -dir I -from 64 -to 0 rtc
create_bd_pin -dir I IO_UIO
create_bd_pin -dir I IO_FPGA
create_bd_pin -dir I IO_STROBE
create_bd_pin -dir O IO_WAIT
create_bd_pin -dir I -from 15 -to 0 IO_DIN
create_bd_pin -dir O -from 15 -to 0 IO_DOUT
create_bd_pin -dir O x_hsync
create_bd_pin -dir O x_vsync
create_bd_pin -dir O x_csync
create_bd_pin -dir O field1
create_bd_pin -dir O lace
create_bd_pin -dir O hblank
create_bd_pin -dir O vblank
create_bd_pin -dir O -from 7 -to 0 red
create_bd_pin -dir O -from 7 -to 0 green
create_bd_pin -dir O -from 7 -to 0 blue
create_bd_pin -dir O -from 1 -to 0 ar
create_bd_pin -dir O -from 2 -to 0 scanline
create_bd_pin -dir O ce_pix
create_bd_pin -dir O -from 4 -to 0 res
create_bd_pin -dir O -from 4 -to 0 ntsc
create_bd_pin -dir O -from 14 -to 0 ldata
create_bd_pin -dir O -from 14 -to 0 rdata
create_bd_pin -dir O -from 8 -to 0 ldata_okk
create_bd_pin -dir O -from 8 -to 0 rdata_okk
create_bd_pin -dir O -from 1 -to 0 aud_mix
create_bd_pin -dir I toccata_ena
create_bd_pin -dir I -from 7 -to 0 toccata_base
create_bd_pin -dir O -from 15 -to 0 toccata_aud_left
create_bd_pin -dir O -from 15 -to 0 toccata_aud_right
create_bd_pin -dir O -from 1 -to 0 cpucfg
create_bd_pin -dir O -from 2 -to 0 cachecfg
create_bd_pin -dir O -from 7 -to 0 memcfg
create_bd_pin -dir O bootrom
create_bd_pin -dir O -from 5 -to 0 ide_ena
create_bd_pin -dir O -from 5 -to 0 ide_fast
create_bd_pin -dir I ide_ext_irq
create_bd_pin -dir O -from 5 -to 0 ide_req
create_bd_pin -dir I -from 4 -to 0 ide_address
create_bd_pin -dir I ide_write
create_bd_pin -dir I -from 15 -to 0 ide_writedata
create_bd_pin -dir I ide_read
create_bd_pin -dir O -from 15 -to 0 ide_readdata
create_bd_pin -dir O -from 1 -to 0 res_o

create_bd_cell -type module -reference userio userio_0
create_bd_cell -type module -reference minimig_m68k_bridge minimig_m68k_bridge_0
create_bd_cell -type module -reference minimig_bankmapper minimig_bankmapper_0
create_bd_cell -type module -reference minimig_sram_bridge minimig_sram_bridge_0
create_bd_cell -type module -reference cart cart_0
create_bd_cell -type module -reference gary gary_0
create_bd_cell -type module -reference minimig_syscontrol minimig_syscontrol_0
create_bd_cell -type module -reference agnus agnus_0
create_bd_cell -type module -reference paula paula_0
create_bd_cell -type hier CORE_Main_Minimig_DENISE
create_bd_cell -type hier CORE_Main_Minimig_GAYLE
create_bd_cell -type module -reference ciaa ciaa_0
create_bd_cell -type module -reference ciab ciab_0
create_bd_cell -type hier CORE_Main_Minimig_Toccata
create_bd_cell -type hier IO_WAIT_Logic
create_bd_cell -type hier m68k_bridge_logic
create_bd_cell -type hier gary_logic
create_bd_cell -type hier x_cpu_ipl_logic
create_bd_cell -type hier ciaa_logic

# ---- hierarchy /emu/CORE_Main_Minimig/CORE_Main_Minimig_DENISE ----
current_bd_instance /emu/CORE_Main_Minimig/CORE_Main_Minimig_DENISE
create_bd_pin -dir I clk
create_bd_pin -dir I clk7_en
create_bd_pin -dir I c1
create_bd_pin -dir I c3
create_bd_pin -dir I cck
create_bd_pin -dir I reset
create_bd_pin -dir I strhor
create_bd_pin -dir I -from 9 -to 1 reg_address_in
create_bd_pin -dir I -from 48 -to 0 chip48
create_bd_pin -dir I -from 16 -to 0 data_in
create_bd_pin -dir O -from 16 -to 0 data_out
create_bd_pin -dir I blank
create_bd_pin -dir O -from 8 -to 0 red
create_bd_pin -dir O -from 8 -to 0 green
create_bd_pin -dir O -from 8 -to 0 blue
create_bd_pin -dir I -from 4 -to 0 a1k
create_bd_pin -dir I -from 4 -to 0 ecs
create_bd_pin -dir I -from 4 -to 0 aga
create_bd_pin -dir O hires
create_bd_pin -dir O shres

# ---- hierarchy /emu/CORE_Main_Minimig/CORE_Main_Minimig_GAYLE ----
current_bd_instance /emu/CORE_Main_Minimig/CORE_Main_Minimig_GAYLE
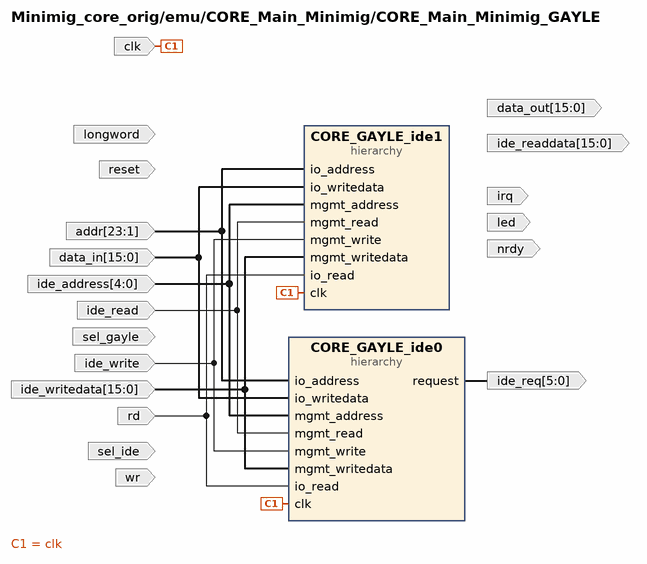
[diagram p7: block diagram inside /emu/CORE_Main_Minimig/CORE_Main_Minimig_GAYLE]
create_bd_pin -dir I clk
create_bd_pin -dir I reset
create_bd_pin -dir I -from 23 -to 1 addr
create_bd_pin -dir I -from 15 -to 0 data_in
create_bd_pin -dir O -from 15 -to 0 data_out
create_bd_pin -dir I rd
create_bd_pin -dir I wr
create_bd_pin -dir I sel_ide
create_bd_pin -dir I sel_gayle
create_bd_pin -dir O irq
create_bd_pin -dir O nrdy
create_bd_pin -dir I longword
create_bd_pin -dir I -from 4 -to 0 ide_address
create_bd_pin -dir I ide_write
create_bd_pin -dir I -from 15 -to 0 ide_writedata
create_bd_pin -dir I ide_read
create_bd_pin -dir O -from 15 -to 0 ide_readdata
create_bd_pin -dir O led
create_bd_pin -dir O -from 5 -to 0 ide_req

create_bd_cell -type hier CORE_GAYLE_ide0
create_bd_cell -type hier CORE_GAYLE_ide1

# ---- hierarchy /emu/CORE_Main_Minimig/CORE_Main_Minimig_GAYLE/CORE_GAYLE_ide0 ----
current_bd_instance /emu/CORE_Main_Minimig/CORE_Main_Minimig_GAYLE/CORE_GAYLE_ide0
create_bd_pin -dir I clk
create_bd_pin -dir I rst_n
create_bd_pin -dir O irq
create_bd_pin -dir O drq
create_bd_pin -dir I use_fast
create_bd_pin -dir O no_data
create_bd_pin -dir O -from 1 -to 0 drive_en
create_bd_pin -dir I -from 3 -to 0 io_address
create_bd_pin -dir I io_read
create_bd_pin -dir O -from 31 -to 0 io_readdata
create_bd_pin -dir I io_write
create_bd_pin -dir I -from 31 -to 0 io_writedata
create_bd_pin -dir I io_32
create_bd_pin -dir O io_wait
create_bd_pin -dir O -from 2 -to 0 request
create_bd_pin -dir I -from 3 -to 0 mgmt_address
create_bd_pin -dir I mgmt_write
create_bd_pin -dir I -from 15 -to 0 mgmt_writedata
create_bd_pin -dir I mgmt_read
create_bd_pin -dir I -from 15 -to 0 mgmt_readdata

# ---- hierarchy /emu/CORE_Main_Minimig/CORE_Main_Minimig_GAYLE/CORE_GAYLE_ide1 ----
current_bd_instance /emu/CORE_Main_Minimig/CORE_Main_Minimig_GAYLE/CORE_GAYLE_ide1
create_bd_pin -dir I clk
create_bd_pin -dir I rst_n
create_bd_pin -dir O irq
create_bd_pin -dir O drq
create_bd_pin -dir I use_fast
create_bd_pin -dir O no_data
create_bd_pin -dir O -from 1 -to 0 drive_en
create_bd_pin -dir I -from 3 -to 0 io_address
create_bd_pin -dir I io_read
create_bd_pin -dir O -from 31 -to 0 io_readdata
create_bd_pin -dir I io_write
create_bd_pin -dir I -from 31 -to 0 io_writedata
create_bd_pin -dir I io_32
create_bd_pin -dir O io_wait
create_bd_pin -dir O -from 2 -to 0 request
create_bd_pin -dir I -from 3 -to 0 mgmt_address
create_bd_pin -dir I mgmt_write
create_bd_pin -dir I -from 15 -to 0 mgmt_writedata
create_bd_pin -dir I mgmt_read
create_bd_pin -dir I -from 15 -to 0 mgmt_readdata

# ---- hierarchy /emu/CORE_Main_Minimig/CORE_Main_Minimig_Toccata ----
current_bd_instance /emu/CORE_Main_Minimig/CORE_Main_Minimig_Toccata
create_bd_pin -dir I clk
create_bd_pin -dir I rst
create_bd_pin -dir I hsync
create_bd_pin -dir I -from 15 -to 0 data_in
create_bd_pin -dir O -from 15 -to 0 data_out
create_bd_pin -dir I -from 15 -to 0 addr
create_bd_pin -dir I rd
create_bd_pin -dir I hwr
create_bd_pin -dir I lwr
create_bd_pin -dir I sel
create_bd_pin -dir O toc_int
create_bd_pin -dir O -from 15 -to 0 out_left
create_bd_pin -dir O -from 15 -to 0 out_right

# ---- hierarchy /emu/CORE_Main_Minimig/IO_WAIT_Logic ----
current_bd_instance /emu/CORE_Main_Minimig/IO_WAIT_Logic
create_bd_pin -dir I Paula_IO_WAIT
create_bd_pin -dir I USERIO1_IO_WAIT
create_bd_pin -dir O IO_WAIT

# ---- hierarchy /emu/CORE_Main_Minimig/m68k_bridge_logic ----
current_bd_instance /emu/CORE_Main_Minimig/m68k_bridge_logic
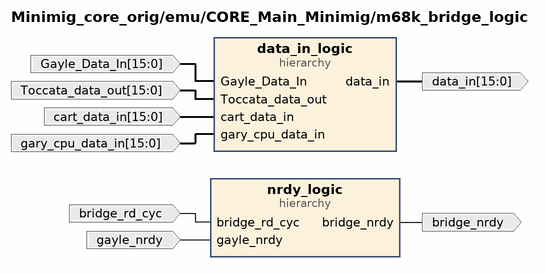
[diagram p8: block diagram inside /emu/CORE_Main_Minimig/m68k_bridge_logic]
create_bd_pin -dir O -from 15 -to 0 data_in
create_bd_pin -dir I -from 15 -to 0 Gayle_Data_In
create_bd_pin -dir I -from 15 -to 0 gary_cpu_data_in
create_bd_pin -dir I -from 15 -to 0 cart_data_in
create_bd_pin -dir I gayle_nrdy
create_bd_pin -dir I bridge_rd_cyc
create_bd_pin -dir O bridge_nrdy
create_bd_pin -dir I -from 15 -to 0 Toccata_data_out

create_bd_cell -type hier nrdy_logic
create_bd_cell -type hier data_in_logic

# ---- hierarchy /emu/CORE_Main_Minimig/m68k_bridge_logic/nrdy_logic ----
current_bd_instance /emu/CORE_Main_Minimig/m68k_bridge_logic/nrdy_logic
create_bd_pin -dir I gayle_nrdy
create_bd_pin -dir I bridge_rd_cyc
create_bd_pin -dir O bridge_nrdy

# ---- hierarchy /emu/CORE_Main_Minimig/m68k_bridge_logic/data_in_logic ----
current_bd_instance /emu/CORE_Main_Minimig/m68k_bridge_logic/data_in_logic
create_bd_pin -dir I -from 15 -to 0 Gayle_Data_In
create_bd_pin -dir I -from 15 -to 0 gary_cpu_data_in
create_bd_pin -dir I -from 15 -to 0 cart_data_in
create_bd_pin -dir O -from 15 -to 0 data_in
create_bd_pin -dir I -from 15 -to 0 Toccata_data_out

# ---- hierarchy /emu/CORE_Main_Minimig/gary_logic ----
current_bd_instance /emu/CORE_Main_Minimig/gary_logic
create_bd_pin -dir O -from 15 -to 0 custom_data_ouy
create_bd_pin -dir I -from 16 -to 0 denise_data_out
create_bd_pin -dir I -from 15 -to 0 agnus_data_out

# ---- hierarchy /emu/CORE_Main_Minimig/x_cpu_ipl_logic ----
current_bd_instance /emu/CORE_Main_Minimig/x_cpu_ipl_logic
create_bd_pin -dir O -from 2 -to 0 x_cpu_ipl
create_bd_pin -dir I cart_int1
create_bd_pin -dir I -from 2 -to 0 paula_ipl

# ---- hierarchy /emu/CORE_Main_Minimig/ciaa_logic ----
current_bd_instance /emu/CORE_Main_Minimig/ciaa_logic
create_bd_pin -dir O -from 7 -to 2 porta_in
create_bd_pin -dir I userio_fire0
create_bd_pin -dir I paula_track0
create_bd_pin -dir I paula_change
create_bd_pin -dir I userio_fire1
create_bd_pin -dir I paula_ready
create_bd_pin -dir I paula_wprot

# ---- hierarchy /emu/CORE_ddram_ctrl_ram2 ----
current_bd_instance /emu/CORE_ddram_ctrl_ram2
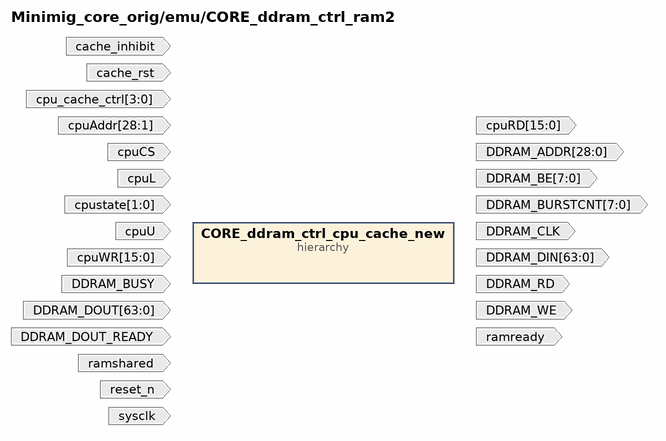
[diagram p9: block diagram inside /emu/CORE_ddram_ctrl_ram2]
create_bd_pin -dir I sysclk
create_bd_pin -dir I reset_n
create_bd_pin -dir I cache_rst
create_bd_pin -dir I cache_inhibit
create_bd_pin -dir I -from 3 -to 0 cpu_cache_ctrl
create_bd_pin -dir O DDRAM_CLK
create_bd_pin -dir I DDRAM_BUSY
create_bd_pin -dir O -from 7 -to 0 DDRAM_BURSTCNT
create_bd_pin -dir O -from 28 -to 0 DDRAM_ADDR
create_bd_pin -dir I -from 63 -to 0 DDRAM_DOUT
create_bd_pin -dir I DDRAM_DOUT_READY
create_bd_pin -dir O DDRAM_RD
create_bd_pin -dir O -from 63 -to 0 DDRAM_DIN
create_bd_pin -dir O -from 7 -to 0 DDRAM_BE
create_bd_pin -dir O DDRAM_WE
create_bd_pin -dir I -from 28 -to 1 cpuAddr
create_bd_pin -dir I cpuCS
create_bd_pin -dir I -from 1 -to 0 cpustate
create_bd_pin -dir I cpuL
create_bd_pin -dir I cpuU
create_bd_pin -dir I -from 15 -to 0 cpuWR
create_bd_pin -dir O -from 15 -to 0 cpuRD
create_bd_pin -dir I ramshared
create_bd_pin -dir O ramready

create_bd_cell -type hier CORE_ddram_ctrl_cpu_cache_new

# ---- hierarchy /emu/CORE_ddram_ctrl_ram2/CORE_ddram_ctrl_cpu_cache_new ----
current_bd_instance /emu/CORE_ddram_ctrl_ram2/CORE_ddram_ctrl_cpu_cache_new
create_bd_pin -dir I clk
create_bd_pin -dir I rst
create_bd_pin -dir I -from 3 -to 0 cpu_cache_ctrl
create_bd_pin -dir I cache_inhibit
create_bd_pin -dir I cpu_cs
create_bd_pin -dir I -from 28 -to 1 cpu_adr
create_bd_pin -dir I -from 1 -to 0 cpu_bs
create_bd_pin -dir I cpu_we
create_bd_pin -dir I cpu_ir
create_bd_pin -dir I cpu_dr
create_bd_pin -dir I -from 15 -to 0 cpu_dat_w
create_bd_pin -dir O -from 15 -to 0 cpu_dat_r
create_bd_pin -dir O cpu_ack
create_bd_pin -dir O wb_en
create_bd_pin -dir I -from 15 -to 0 sdr_dat_r
create_bd_pin -dir O sdr_read_req
create_bd_pin -dir I sdr_read_ack
create_bd_pin -dir I snoop_act
create_bd_pin -dir I -from 28 -to 1 snoop_adr
create_bd_pin -dir I -from 15 -to 0 snoop_dat_w
create_bd_pin -dir I -from 1 -to 0 snoop_bs

# ---- hierarchy /emu/CORE_sdram_ctrl_ram1 ----
current_bd_instance /emu/CORE_sdram_ctrl_ram1
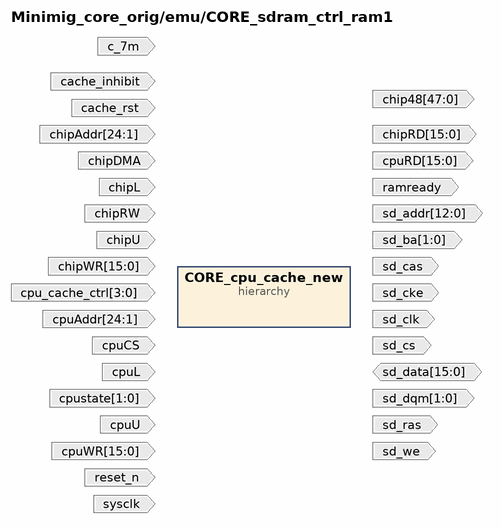
[diagram p10: block diagram inside /emu/CORE_sdram_ctrl_ram1]
create_bd_pin -dir I sysclk
create_bd_pin -dir I c_7m
create_bd_pin -dir I reset_n
create_bd_pin -dir I cache_rst
create_bd_pin -dir I cache_inhibit
create_bd_pin -dir I -from 3 -to 0 cpu_cache_ctrl
create_bd_pin -dir O -from 12 -to 0 sd_addr
create_bd_pin -dir O -from 1 -to 0 sd_ba
create_bd_pin -dir O sd_cs
create_bd_pin -dir O sd_we
create_bd_pin -dir O sd_ras
create_bd_pin -dir O sd_cas
create_bd_pin -dir O -from 1 -to 0 sd_dqm
create_bd_pin -dir IO -from 15 -to 0 sd_data
create_bd_pin -dir O sd_clk
create_bd_pin -dir O sd_cke
create_bd_pin -dir I -from 24 -to 1 chipAddr
create_bd_pin -dir I chipL
create_bd_pin -dir I chipU
create_bd_pin -dir I chipRW
create_bd_pin -dir I chipDMA
create_bd_pin -dir I -from 15 -to 0 chipWR
create_bd_pin -dir O -from 15 -to 0 chipRD
create_bd_pin -dir O -from 47 -to 0 chip48
create_bd_pin -dir I -from 24 -to 1 cpuAddr
create_bd_pin -dir I cpuCS
create_bd_pin -dir I -from 1 -to 0 cpustate
create_bd_pin -dir I cpuL
create_bd_pin -dir I cpuU
create_bd_pin -dir I -from 15 -to 0 cpuWR
create_bd_pin -dir O -from 15 -to 0 cpuRD
create_bd_pin -dir O ramready

create_bd_cell -type hier CORE_cpu_cache_new

# ---- hierarchy /emu/CORE_sdram_ctrl_ram1/CORE_cpu_cache_new ----
current_bd_instance /emu/CORE_sdram_ctrl_ram1/CORE_cpu_cache_new
create_bd_pin -dir I clk
create_bd_pin -dir I rst
create_bd_pin -dir I -from 3 -to 0 cpu_cache_ctrl
create_bd_pin -dir I cache_inhibit
create_bd_pin -dir I cpu_cs
create_bd_pin -dir I -from 28 -to 1 cpu_adr
create_bd_pin -dir I -from 1 -to 0 cpu_bs
create_bd_pin -dir I cpu_we
create_bd_pin -dir I cpu_ir
create_bd_pin -dir I cpu_dr
create_bd_pin -dir I -from 15 -to 0 cpu_dat_w
create_bd_pin -dir O -from 15 -to 0 cpu_dat_r
create_bd_pin -dir O cpu_ack
create_bd_pin -dir O wb_en
create_bd_pin -dir I -from 15 -to 0 sdr_dat_r
create_bd_pin -dir O sdr_read_req
create_bd_pin -dir I sdr_read_ack
create_bd_pin -dir I snoop_act
create_bd_pin -dir I -from 28 -to 1 snoop_adr
create_bd_pin -dir I -from 15 -to 0 snoop_dat_w
create_bd_pin -dir I -from 1 -to 0 snoop_bs

# ---- hierarchy /emu/CORE_Main_fastchip ----
current_bd_instance /emu/CORE_Main_fastchip
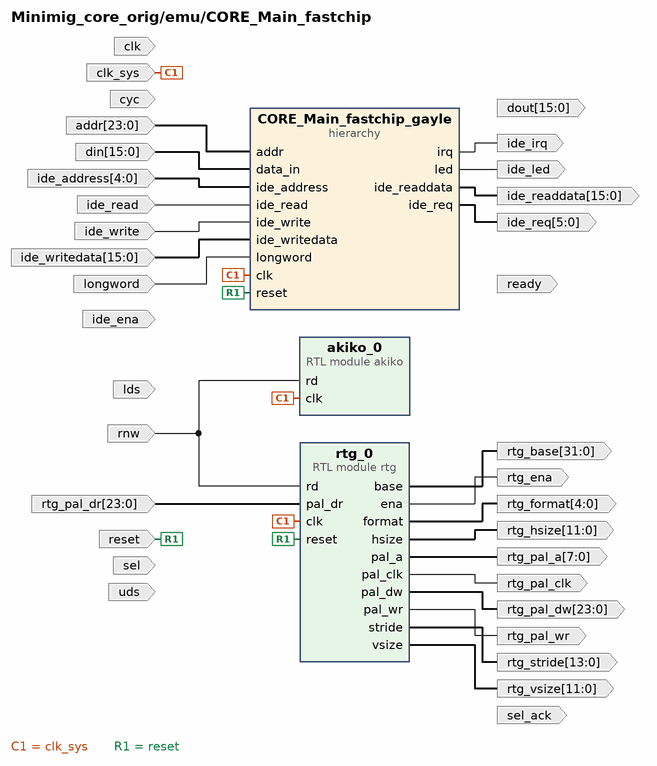
[diagram p11: block diagram inside /emu/CORE_Main_fastchip]
create_bd_pin -dir I cyc
create_bd_pin -dir I clk_sys
create_bd_pin -dir I reset
create_bd_pin -dir I sel
create_bd_pin -dir O sel_ack
create_bd_pin -dir O ready
create_bd_pin -dir I -from 23 -to 0 addr
create_bd_pin -dir I -from 15 -to 0 din
create_bd_pin -dir O -from 15 -to 0 dout
create_bd_pin -dir I lds
create_bd_pin -dir I uds
create_bd_pin -dir I rnw
create_bd_pin -dir I longword
create_bd_pin -dir O rtg_ena
create_bd_pin -dir O -from 11 -to 0 rtg_hsize
create_bd_pin -dir O -from 11 -to 0 rtg_vsize
create_bd_pin -dir O -from 4 -to 0 rtg_format
create_bd_pin -dir O -from 31 -to 0 rtg_base
create_bd_pin -dir O -from 13 -to 0 rtg_stride
create_bd_pin -dir O rtg_pal_clk
create_bd_pin -dir O -from 23 -to 0 rtg_pal_dw
create_bd_pin -dir I -from 23 -to 0 rtg_pal_dr
create_bd_pin -dir O -from 7 -to 0 rtg_pal_a
create_bd_pin -dir O rtg_pal_wr
create_bd_pin -dir I ide_ena
create_bd_pin -dir O ide_irq
create_bd_pin -dir O -from 5 -to 0 ide_req
create_bd_pin -dir I -from 4 -to 0 ide_address
create_bd_pin -dir I ide_write
create_bd_pin -dir I -from 15 -to 0 ide_writedata
create_bd_pin -dir I ide_read
create_bd_pin -dir O -from 15 -to 0 ide_readdata
create_bd_pin -dir O ide_led
create_bd_pin -dir I clk

create_bd_cell -type module -reference rtg rtg_0
create_bd_cell -type hier CORE_Main_fastchip_gayle
create_bd_cell -type module -reference akiko akiko_0

# ---- hierarchy /emu/CORE_Main_fastchip/CORE_Main_fastchip_gayle ----
current_bd_instance /emu/CORE_Main_fastchip/CORE_Main_fastchip_gayle
create_bd_pin -dir I clk
create_bd_pin -dir I reset
create_bd_pin -dir I -from 23 -to 1 addr
create_bd_pin -dir I -from 15 -to 0 data_in
create_bd_pin -dir O -from 15 -to 0 data_out
create_bd_pin -dir I rd
create_bd_pin -dir I wr
create_bd_pin -dir I sel_ide
create_bd_pin -dir I sel_gayle
create_bd_pin -dir O irq
create_bd_pin -dir O nrdy
create_bd_pin -dir I longword
create_bd_pin -dir O -from 5 -to 0 ide_req
create_bd_pin -dir I -from 4 -to 0 ide_address
create_bd_pin -dir I ide_write
create_bd_pin -dir I -from 15 -to 0 ide_writedata
create_bd_pin -dir I ide_read
create_bd_pin -dir O -from 15 -to 0 ide_readdata
create_bd_pin -dir O led

# ---- hierarchy /emu/CORE_cpu_wrapper ----
current_bd_instance /emu/CORE_cpu_wrapper
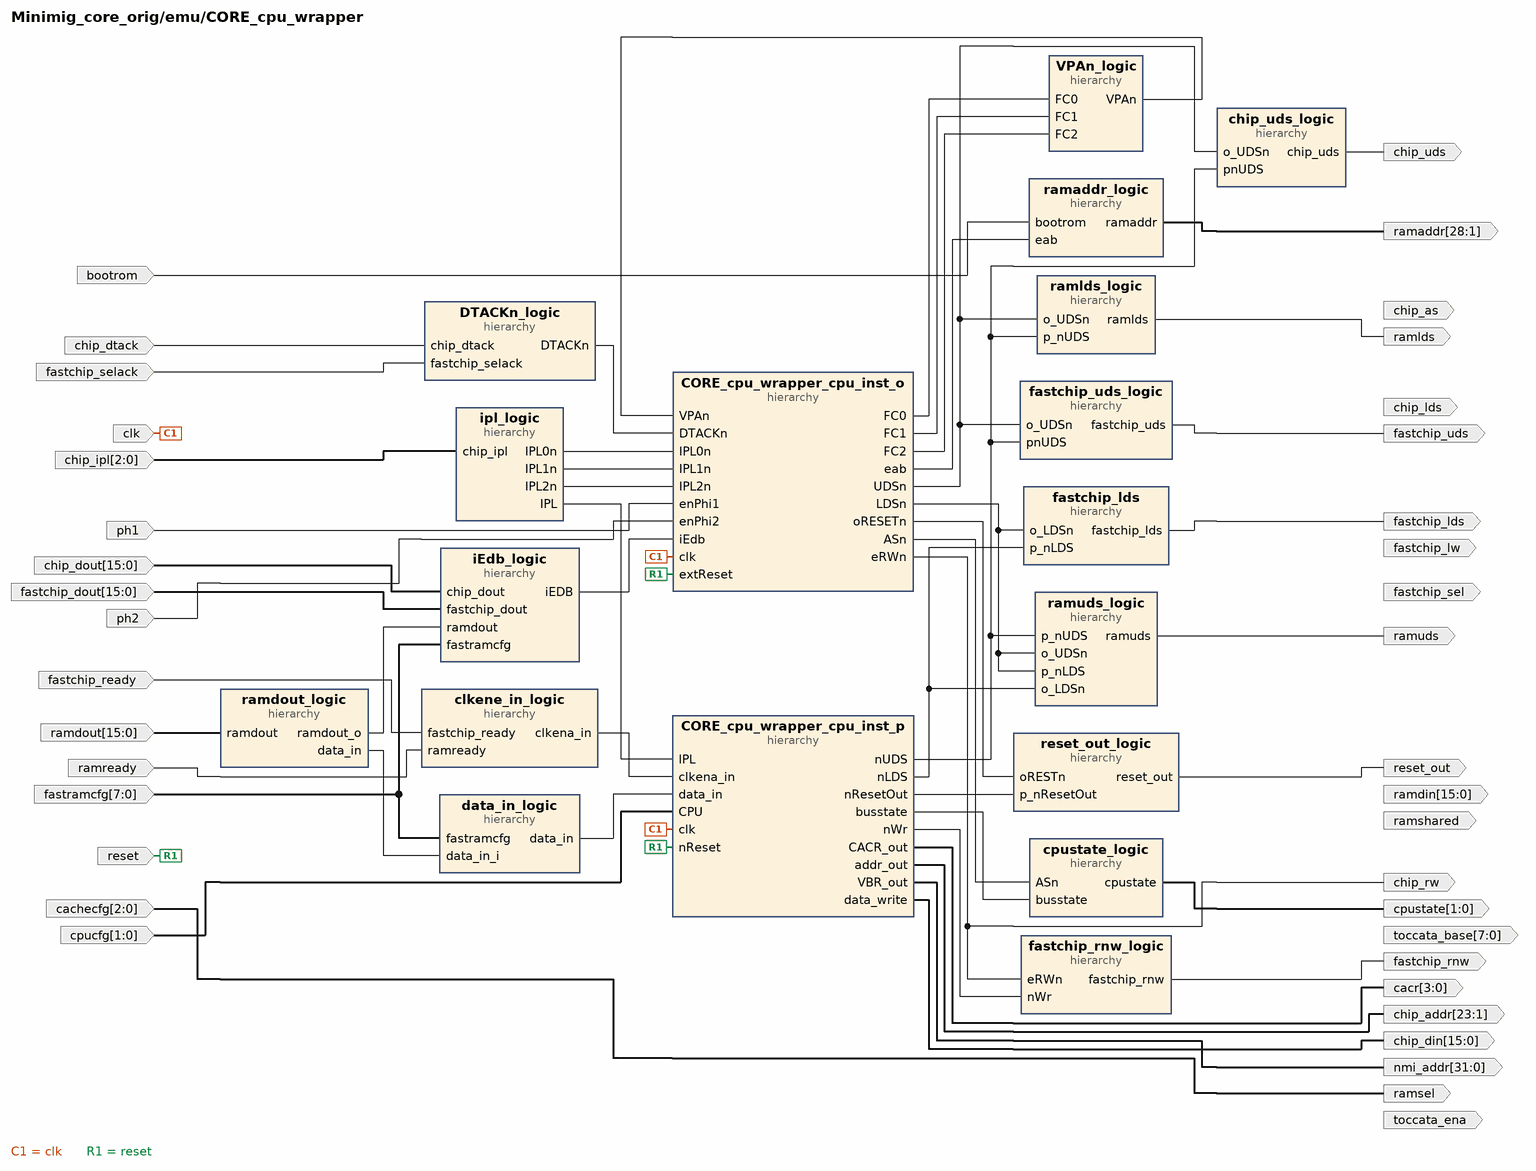
[diagram p12: block diagram inside /emu/CORE_cpu_wrapper]
create_bd_pin -dir I reset
create_bd_pin -dir O reset_out
create_bd_pin -dir I ph1
create_bd_pin -dir I ph2
create_bd_pin -dir I -from 1 -to 0 cpucfg
create_bd_pin -dir I -from 7 -to 0 fastramcfg
create_bd_pin -dir I -from 2 -to 0 cachecfg
create_bd_pin -dir I bootrom
create_bd_pin -dir O -from 23 -to 1 chip_addr
create_bd_pin -dir I -from 15 -to 0 chip_dout
create_bd_pin -dir O -from 15 -to 0 chip_din
create_bd_pin -dir O chip_as
create_bd_pin -dir O chip_uds
create_bd_pin -dir O chip_lds
create_bd_pin -dir O chip_rw
create_bd_pin -dir I chip_dtack
create_bd_pin -dir I -from 2 -to 0 chip_ipl
create_bd_pin -dir I -from 15 -to 0 fastchip_dout
create_bd_pin -dir O fastchip_sel
create_bd_pin -dir O fastchip_lds
create_bd_pin -dir O fastchip_uds
create_bd_pin -dir O fastchip_rnw
create_bd_pin -dir O fastchip_lw
create_bd_pin -dir I fastchip_selack
create_bd_pin -dir I fastchip_ready
create_bd_pin -dir O ramsel
create_bd_pin -dir O -from 28 -to 1 ramaddr
create_bd_pin -dir O -from 15 -to 0 ramdin
create_bd_pin -dir I -from 15 -to 0 ramdout
create_bd_pin -dir I ramready
create_bd_pin -dir O ramlds
create_bd_pin -dir O ramuds
create_bd_pin -dir O ramshared
create_bd_pin -dir O toccata_ena
create_bd_pin -dir O -from 7 -to 0 toccata_base
create_bd_pin -dir O -from 1 -to 0 cpustate
create_bd_pin -dir O -from 3 -to 0 cacr
create_bd_pin -dir O -from 31 -to 0 nmi_addr
create_bd_pin -dir I clk

create_bd_cell -type hier CORE_cpu_wrapper_cpu_inst_p
create_bd_cell -type hier CORE_cpu_wrapper_cpu_inst_o
create_bd_cell -type hier ipl_logic
create_bd_cell -type hier iEdb_logic
create_bd_cell -type hier clkene_in_logic
create_bd_cell -type hier DTACKn_logic
create_bd_cell -type hier cpustate_logic
create_bd_cell -type hier VPAn_logic
create_bd_cell -type hier ramdout_logic
create_bd_cell -type hier fastchip_rnw_logic
create_bd_cell -type hier fastchip_uds_logic
create_bd_cell -type hier chip_uds_logic
create_bd_cell -type hier fastchip_lds
create_bd_cell -type hier ramlds_logic
create_bd_cell -type hier reset_out_logic
create_bd_cell -type hier ramuds_logic
create_bd_cell -type hier ramaddr_logic
create_bd_cell -type hier data_in_logic

# ---- hierarchy /emu/CORE_cpu_wrapper/CORE_cpu_wrapper_cpu_inst_p ----
current_bd_instance /emu/CORE_cpu_wrapper/CORE_cpu_wrapper_cpu_inst_p
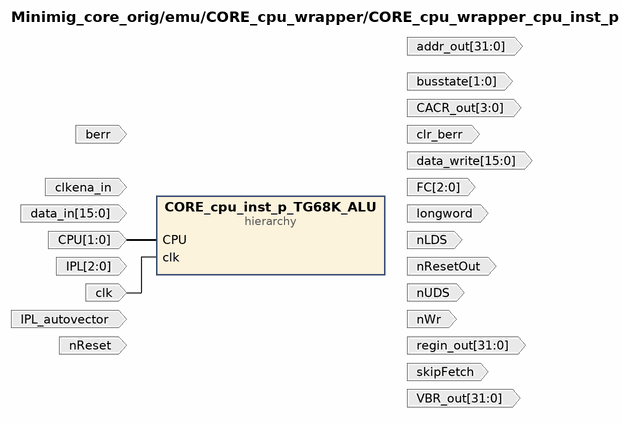
[diagram p13: block diagram inside /emu/CORE_cpu_wrapper/CORE_cpu_wrapper_cpu_inst_p]
create_bd_pin -dir I clk
create_bd_pin -dir I nReset
create_bd_pin -dir I clkena_in
create_bd_pin -dir I IPL_autovector
create_bd_pin -dir I berr
create_bd_pin -dir I -from 15 -to 0 data_in
create_bd_pin -dir I -from 2 -to 0 IPL
create_bd_pin -dir I -from 1 -to 0 CPU
create_bd_pin -dir O -from 31 -to 0 addr_out
create_bd_pin -dir O -from 15 -to 0 data_write
create_bd_pin -dir O nWr
create_bd_pin -dir O nUDS
create_bd_pin -dir O nLDS
create_bd_pin -dir O -from 1 -to 0 busstate
create_bd_pin -dir O longword
create_bd_pin -dir O nResetOut
create_bd_pin -dir O -from 2 -to 0 FC
create_bd_pin -dir O clr_berr
create_bd_pin -dir O skipFetch
create_bd_pin -dir O -from 31 -to 0 regin_out
create_bd_pin -dir O -from 3 -to 0 CACR_out
create_bd_pin -dir O -from 31 -to 0 VBR_out

create_bd_cell -type hier CORE_cpu_inst_p_TG68K_ALU

# ---- hierarchy /emu/CORE_cpu_wrapper/CORE_cpu_wrapper_cpu_inst_p/CORE_cpu_inst_p_TG68K_ALU ----
current_bd_instance /emu/CORE_cpu_wrapper/CORE_cpu_wrapper_cpu_inst_p/CORE_cpu_inst_p_TG68K_ALU
create_bd_pin -dir I clk
create_bd_pin -dir I Reset
create_bd_pin -dir I clkena_lw
create_bd_pin -dir I -from 1 -to 0 CPU
create_bd_pin -dir I execOPC
create_bd_pin -dir I decodeOPC
create_bd_pin -dir I exe_condition
create_bd_pin -dir I exec_tas
create_bd_pin -dir I long_start
create_bd_pin -dir I non_aligned
create_bd_pin -dir I check_aligned
create_bd_pin -dir I movem_presub
create_bd_pin -dir I set_stop
create_bd_pin -dir I Z_error
create_bd_pin -dir I -from 1 -to 0 rot_bits
create_bd_pin -dir I -from 15 -to 0 exec
create_bd_pin -dir I -from 31 -to 0 OP1out
create_bd_pin -dir I -from 31 -to 0 OP2out
create_bd_pin -dir I -from 31 -to 0 reg_QA
create_bd_pin -dir I -from 31 -to 0 reg_QB
create_bd_pin -dir I -from 15 -to 0 opcode
create_bd_pin -dir I -from 15 -to 0 exe_opcode
create_bd_pin -dir I -from 1 -to 0 exe_datatype
create_bd_pin -dir I -from 15 -to 0 sndOPC
create_bd_pin -dir I -from 15 -to 0 last_data_read
create_bd_pin -dir I -from 15 -to 0 data_read
create_bd_pin -dir I -from 7 -to 0 FlagsSR
create_bd_pin -dir I micro_state
create_bd_pin -dir I -from 7 -to 0 bf_ext_in
create_bd_pin -dir I -from 7 -to 0 bf_ext_out
create_bd_pin -dir I -from 5 -to 0 bf_shift
create_bd_pin -dir I -from 5 -to 0 bf_width
create_bd_pin -dir I -from 31 -to 0 bf_ffo_offset
create_bd_pin -dir I -from 4 -to 0 bf_loffset
create_bd_pin -dir IO set_V_Flag
create_bd_pin -dir IO -from 7 -to 0 Flags
create_bd_pin -dir IO -from 2 -to 0 c_out
create_bd_pin -dir IO -from 31 -to 0 addsub_q
create_bd_pin -dir O -from 31 -to 0 ALUout
